# EAGLE schematic Comms_Main (EAGLE 7.7.0)

## Sheet 1 of 8
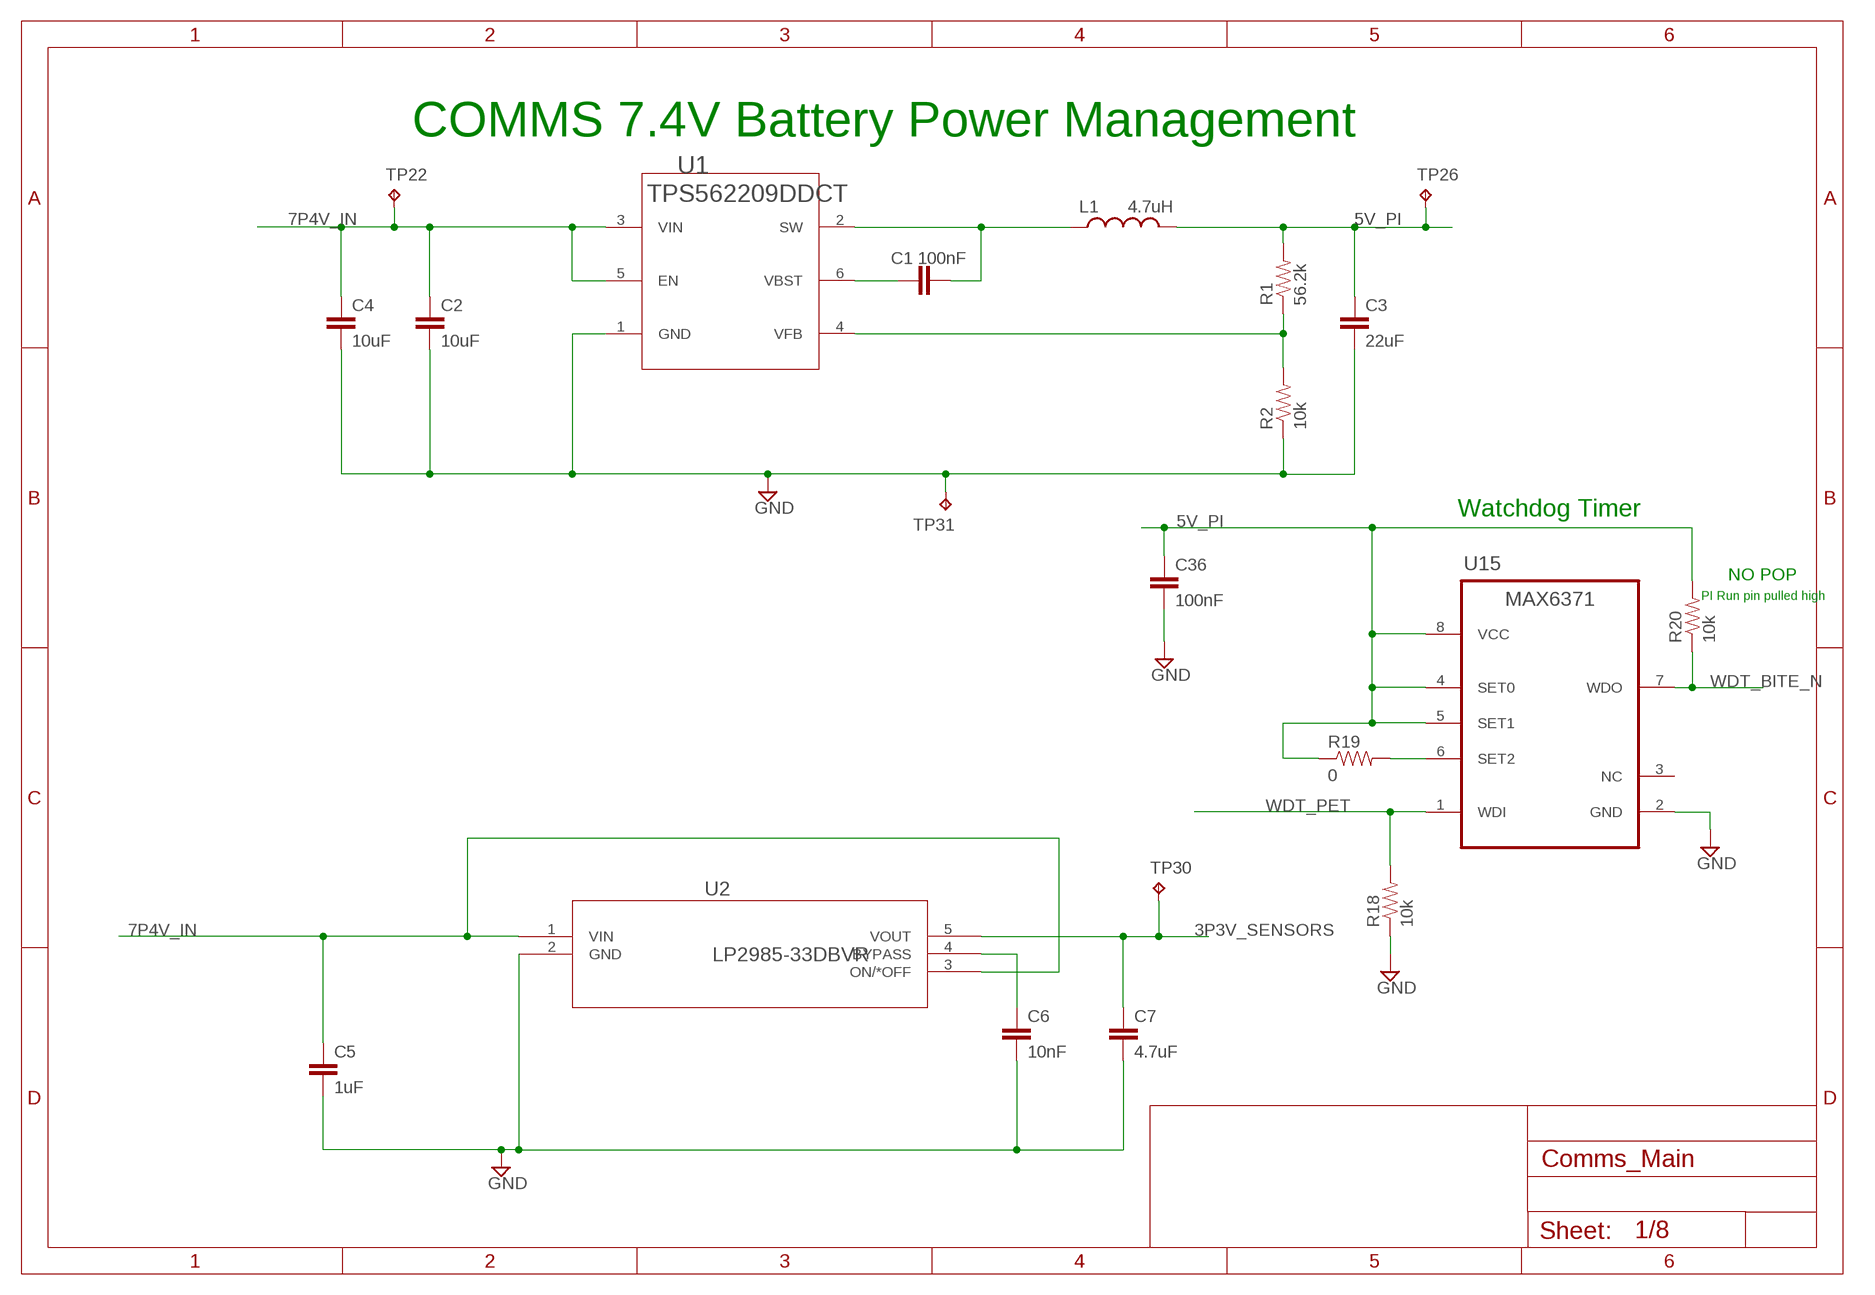
[diagram p0: schematic, sheet 1]

### Parts
C1  100nF  CAP_100NF0_0805  [C0805]
C2  10uF  CAP_10UF0_0805  [C0805]
C3  22uF  CAP_22UF0_1206  [C1206]
C4  10uF  CAP_10UF0_0805  [C0805]
C5  1uF  CAP_1UF0_0603  [C0603]
C6  10nF  CAP_10NF0_0805  [C0805]
C7  4.7uF  CAP_4UH7_0603  [C0603]
C36  100nF  CAP_100NF0_0603  [C0603]
L1  4.7uH  L_4UH7  [SRN6045]
R1  56.2k  RES_56R2_0603  [R0603]
R2  10k  RES_10R0_0603  [R0603]
R18  10k  RES_10R0_0603  [R0603]
R19  0  RES_0R0_0603  [R0603]
R20  10k  RES_10R0_0603  [R0603]
TP22  TPTP15R  [TP15R]
TP26  TPTP15R  [TP15R]
TP30  TPTP15R  [TP15R]
TP31  TPTP15R  [TP15R]
U1  TPS562209DDCT  TPS562209DDCR  [DDC0006A]
U2  LP2985-33DBVR  LP2985-33_DBV_5  [DBV5]
U15  MAX6371  MAX63XX71KA_SOT23  [SOT23P130X045-8N]

### Nets
3P3V_SENSORS: C7.1 TP30.TP U2.5(VOUT) ; also sheet 4,6
5V_PI: C3.1 C36.1 L1.2 R1.2 R19.1 R20.2 TP26.TP U15.4(SET0) U15.5(SET1) U15.8(VCC) ; also sheet 8
7P4V_IN: C2.1 C4.1 C5.1 TP22.TP U1.3(VIN) U1.5(EN) U2.1(VIN) U2.3(ON/*OFF) ; also sheet 8
GND: C2.2 C3.2 C4.2 C5.2 C6.2 C7.2 C36.2 R2.1 R18.1 TP31.TP U1.1(GND) U2.2(GND) U15.2(GND) ; also sheet 2,3,4,5,6,7,8
N$1: C1.1 U1.6(VBST)
N$2: C1.2 L1.1 U1.2(SW)
N$3: R1.1 R2.2 U1.4(VFB)
N$4: C6.1 U2.4(BYPASS)
N$59: R19.2 U15.6(SET2)
WDT_BITE_N: R20.1 U15.7(WDO) ; also sheet 8
WDT_PET: R18.2 U15.1(WDI) ; also sheet 8
Unconnected: U15.3(NC)

### Notes on the sheet
- COMMS 7.4V Battery Power Management
- Watchdog Timer
- NO POP
- PI Run pin pulled high

## Sheet 2 of 8
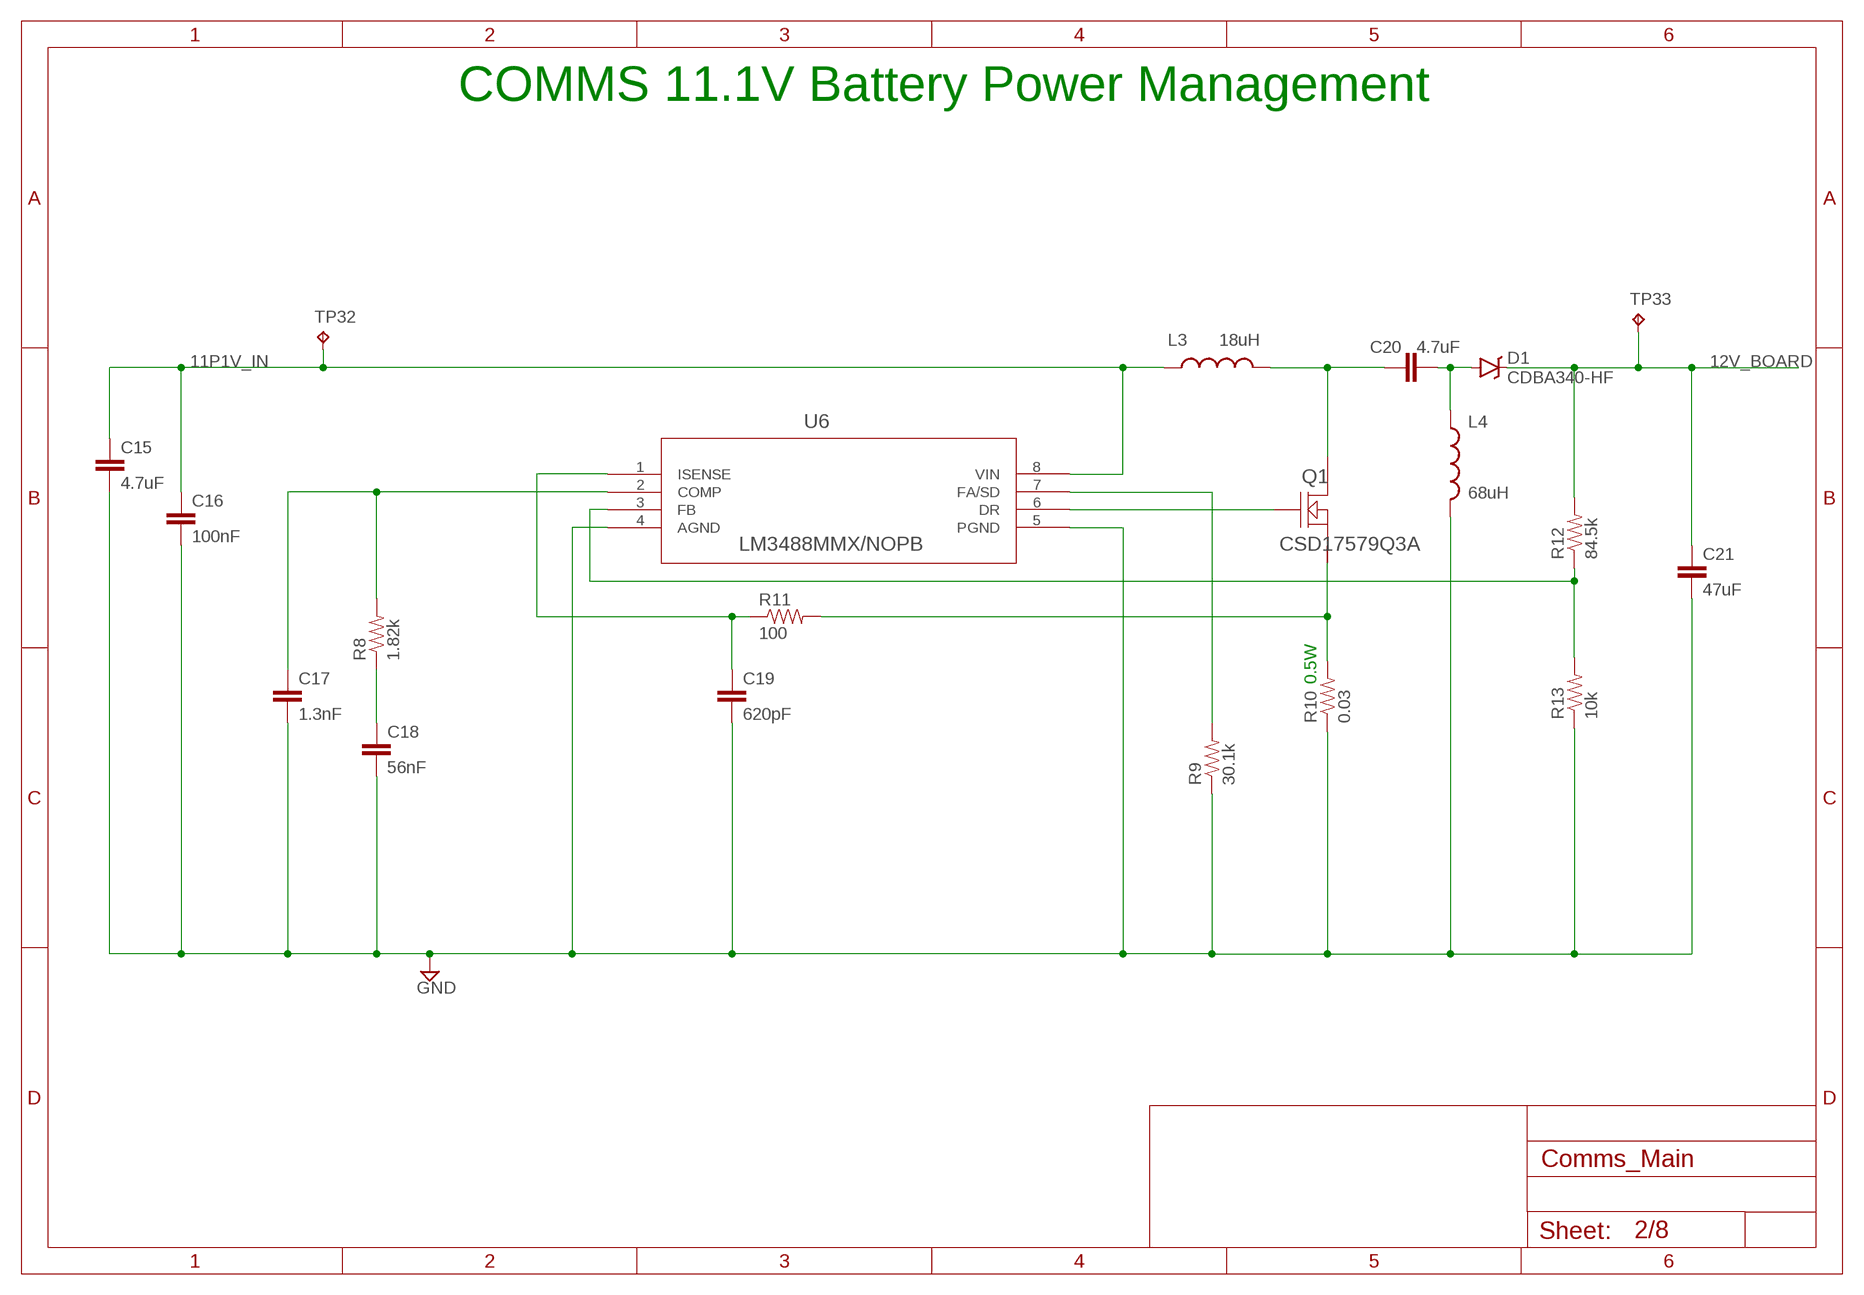
[diagram p1: schematic, sheet 2]

### Parts
C15  4.7uF  CAP_4UH7_1210  [C1210]
C16  100nF  CAP_100NF0_0805  [C0805]
C17  1.3nF  CAP_1NF3_0805  [C0805]
C18  56nF  CAP_56NF0_0603  [C0603]
C19  620pF  CAP_620PF0_0805  [C0805]
C20  4.7uF  CAP_4UH7_0805  [C0805]
C21  47uF  CAP_47UF0_1210  [C1210]
D1  CDBA340-HF  DIODE-SCHOTTKY_DO-214AC  [DO-214AC]
L3  18uH  L_18UH0-180ML  [SDR1006]
L4  68uH  L_68UH0-680ML  [SDR1806]
Q1  CSD17579Q3A  [DNH0008A]
R8  1.82k  RES_1R82_0805  [R0805]
R9  30.1k  RES_30R1_0603  [R0603]
R10  0.03  RES_0RS030_0805  [R0805]
R11  100  RES_0R100_0603  [R0603]
R12  84.5k  RES_84R5_0603  [R0603]
R13  10k  RES_10R0_0603  [R0603]
TP32  TPTP15R  [TP15R]
TP33  TPTP15R  [TP15R]
U6  LM3488MMX/NOPB  [MUA08A]

### Nets
11P1V_IN: C15.1 C16.1 L3.1 TP32.TP U6.8(VIN) ; also sheet 3,8
12V_BOARD: C21.1 D1.C R12.2 TP33.TP ; also sheet 3,8
GND: C15.2 C16.2 C17.2 C18.2 C19.2 C21.2 L4.2 R9.1 R10.1 R13.1 U6.4(AGND) U6.5(PGND) ; also sheet 1,3,4,5,6,7,8
N$12: C18.1 R8.1
N$13: C17.1 R8.2 U6.2(COMP)
N$14: R9.2 U6.7(FA/SD)
N$15: C19.1 R11.1 U6.1(ISENSE)
N$16: Q1.4(GATE) U6.6(DR)
N$17: Q1.1(SOURCE_2) R10.2 R11.2
N$18: C20.1 L3.2 Q1.5(DRAIN_2)
N$19: C20.2 D1.A L4.1
N$21: R12.1 R13.2 U6.3(FB)

### Notes on the sheet
- COMMS 11.1V Battery Power Management
- 0.5W

## Sheet 3 of 8
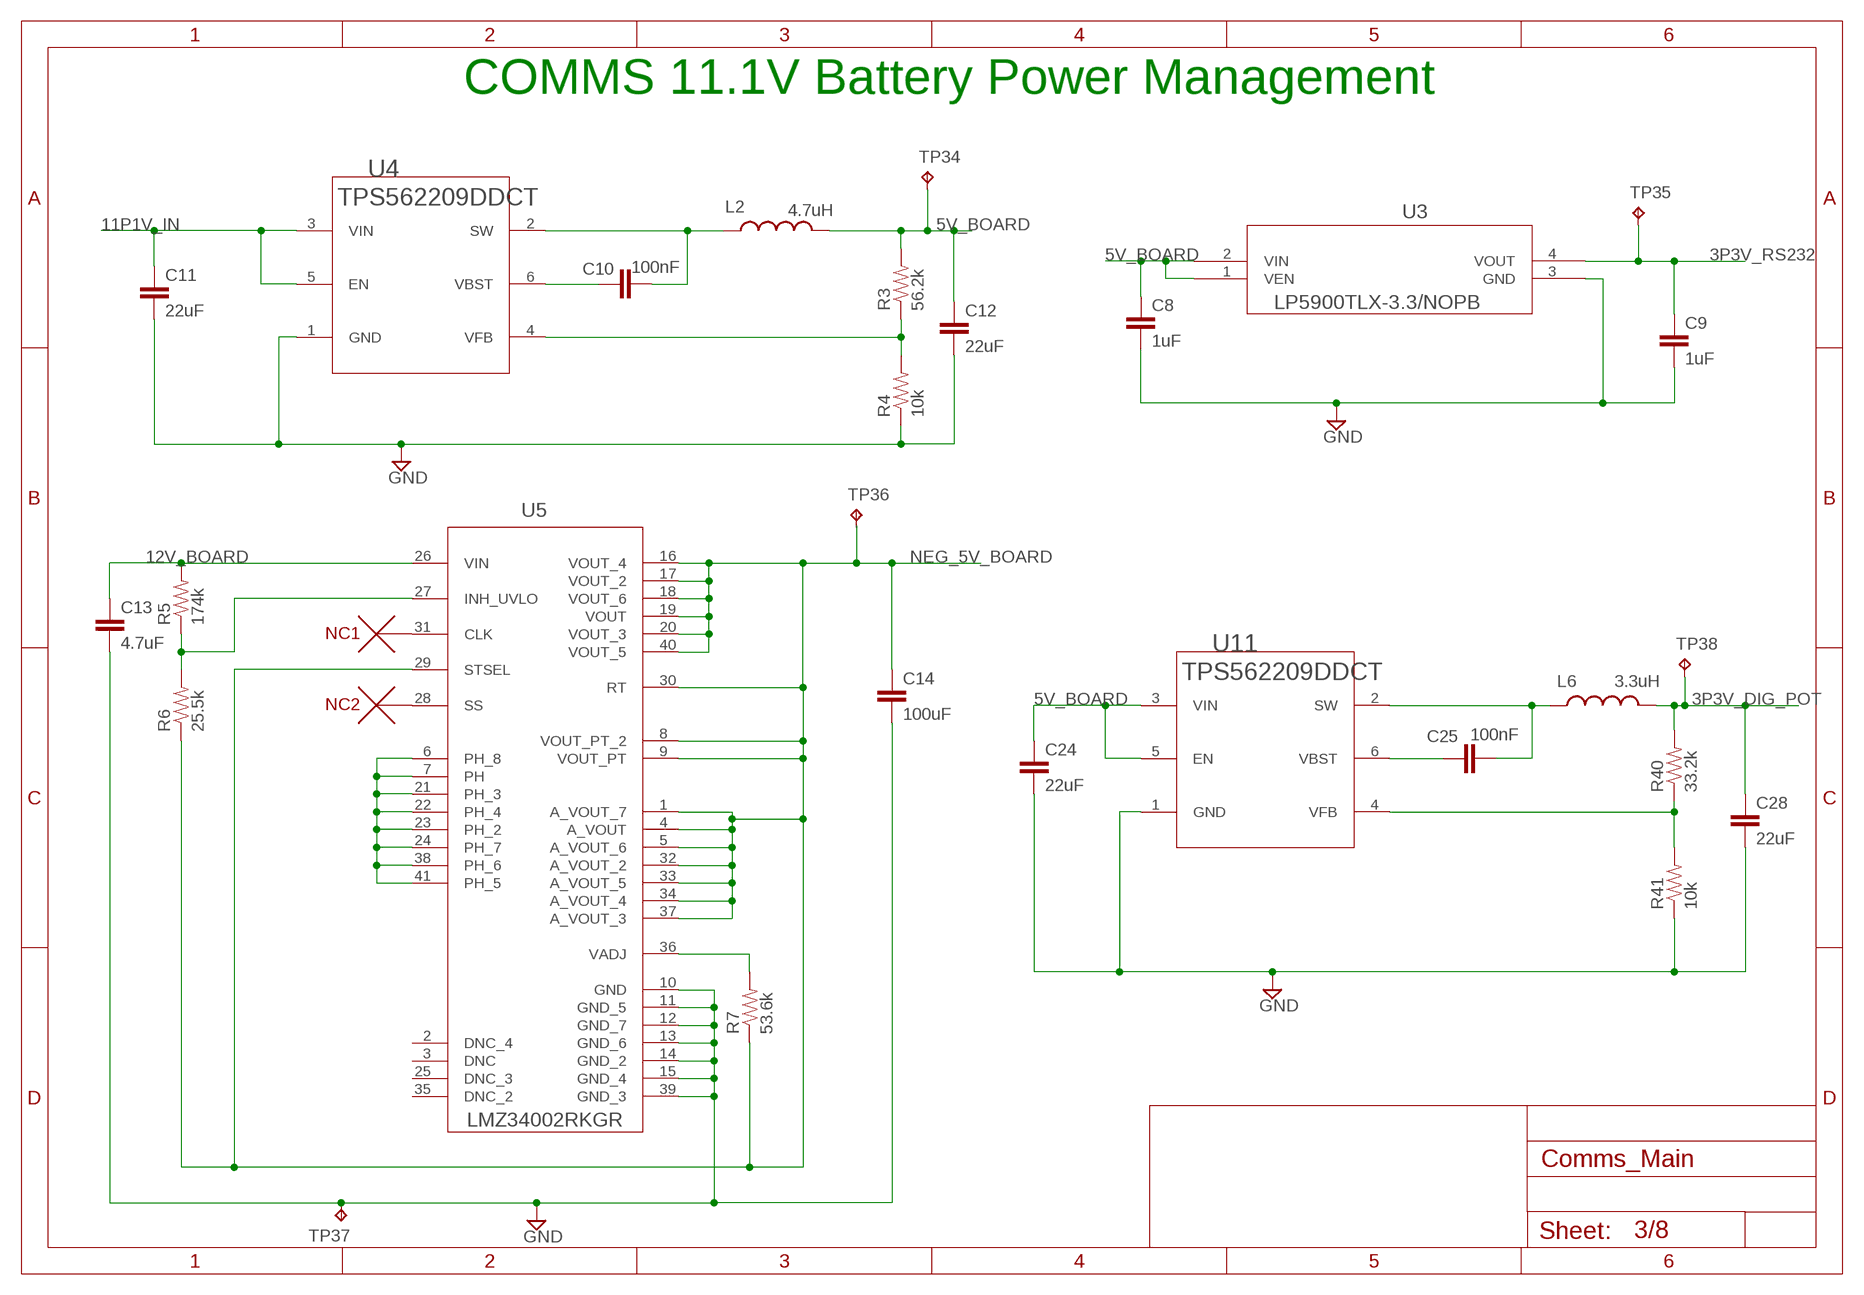
[diagram p2: schematic, sheet 3]

### Parts
C8  1uF  CAP_1UF0_0603  [C0603]
C9  1uF  CAP_1UF0_0603  [C0603]
C10  100nF  CAP_100NF0_0805  [C0805]
C11  22uF  CAP_22UF0_1210  [C1210]
C12  22uF  CAP_22UF0_1206  [C1206]
C13  4.7uF  CAP_4UH7_0805  [C0805]
C14  100uF  CAP_100UF0_1206  [C1206]
C24  22uF  CAP_22UF0_1206  [C1206]
C25  100nF  CAP_100NF0_0805  [C0805]
C28  22uF  CAP_22UF0_1206  [C1206]
L2  4.7uH  L_4UH7  [SRN6045]
L6  3.3uH  L_3UH3  [SRN6045]
NC1  NC  NO_CONNECT  (no package)
NC2  NC  NO_CONNECT  (no package)
R3  56.2k  RES_56R2_0603  [R0603]
R4  10k  RES_10R0_0603  [R0603]
R5  174k  RES_174R0_0603  [R0603]
R6  25.5k  RES_25R5_0603  [R0603]
R7  53.6k  RES_53R6_0603  [R0603]
R40  33.2k  RES_33R2_0603  [R0603]
R41  10k  RES_10R0_0603  [R0603]
TP34  TPTP15R  [TP15R]
TP35  TPTP15R  [TP15R]
TP36  TPTP15R  [TP15R]
TP37  TPTP15R  [TP15R]
TP38  TPTP15R  [TP15R]
U3  LP5900TLX-3.3/NOPB  [TLA04BCA]
U4  TPS562209DDCT  TPS562209DDCR  [DDC0006A]
U5  LMZ34002RKGR  [RKG0041A]
U11  TPS562209DDCT  TPS562209DDCR  [DDC0006A]

### Nets
3P3V_DIG_POT: C28.1 L6.2 R40.2 TP38.TP ; also sheet 6
3P3V_RS232: C9.1 TP35.TP U3.4(VOUT) ; also sheet 7
5V_BOARD: C8.1 C12.1 C24.1 L2.2 R3.2 TP34.TP U3.1(VEN) U3.2(VIN) U11.3(VIN) U11.5(EN) ; also sheet 7,8
11P1V_IN: C11.1 U4.3(VIN) U4.5(EN) ; also sheet 2,8
12V_BOARD: C13.1 R5.2 U5.26(VIN) ; also sheet 2,8
GND: C8.2 C9.2 C11.2 C12.2 C13.2 C14.2 C24.2 C28.2 R4.1 R41.1 TP37.TP U3.3(GND) U4.1(GND) U5.10(GND) U5.11(GND_5) U5.12(GND_7) U5.13(GND_6) U5.14(GND_2) U5.15(GND_4) U5.39(GND_3) U11.1(GND) ; also sheet 1,2,4,5,6,7,8
N$5: C10.1 U4.6(VBST)
N$6: C10.2 L2.1 U4.2(SW)
N$7: R3.1 R4.2 U4.4(VFB)
N$8: C25.2 L6.1 U11.2(SW)
N$9: R5.1 R6.2 U5.27(INH_UVLO)
N$10: R7.2 U5.36(VADJ)
N$11: U5.6(PH_8) U5.7(PH) U5.21(PH_3) U5.22(PH_4) U5.23(PH_2) U5.24(PH_7) U5.38(PH_6) U5.41(PH_5)
N$47: NC1.NC U5.31(CLK)
N$48: R40.1 R41.2 U11.4(VFB)
N$51: NC2.NC U5.28(SS)
N$61: C25.1 U11.6(VBST)
NEG_5V_BOARD: C14.1 R6.1 R7.1 U5.1(A_VOUT_7) U5.4(A_VOUT) U5.5(A_VOUT_6) U5.8(VOUT_PT_2) U5.9(VOUT_PT) U5.16(VOUT_4) U5.17(VOUT_2) U5.18(VOUT_6) U5.19(VOUT) U5.20(VOUT_3) U5.29(STSEL) U5.30(RT) U5.32(A_VOUT_2) U5.33(A_VOUT_5) U5.34(A_VOUT_4) U5.37(A_VOUT_3) U5.40(VOUT_5) ; also sheet 7
Unconnected: TP36.TP U5.2(DNC_4) U5.3(DNC) U5.25(DNC_3) U5.35(DNC_2)

### Notes on the sheet
- COMMS 11.1V Battery Power Management

## Sheet 4 of 8
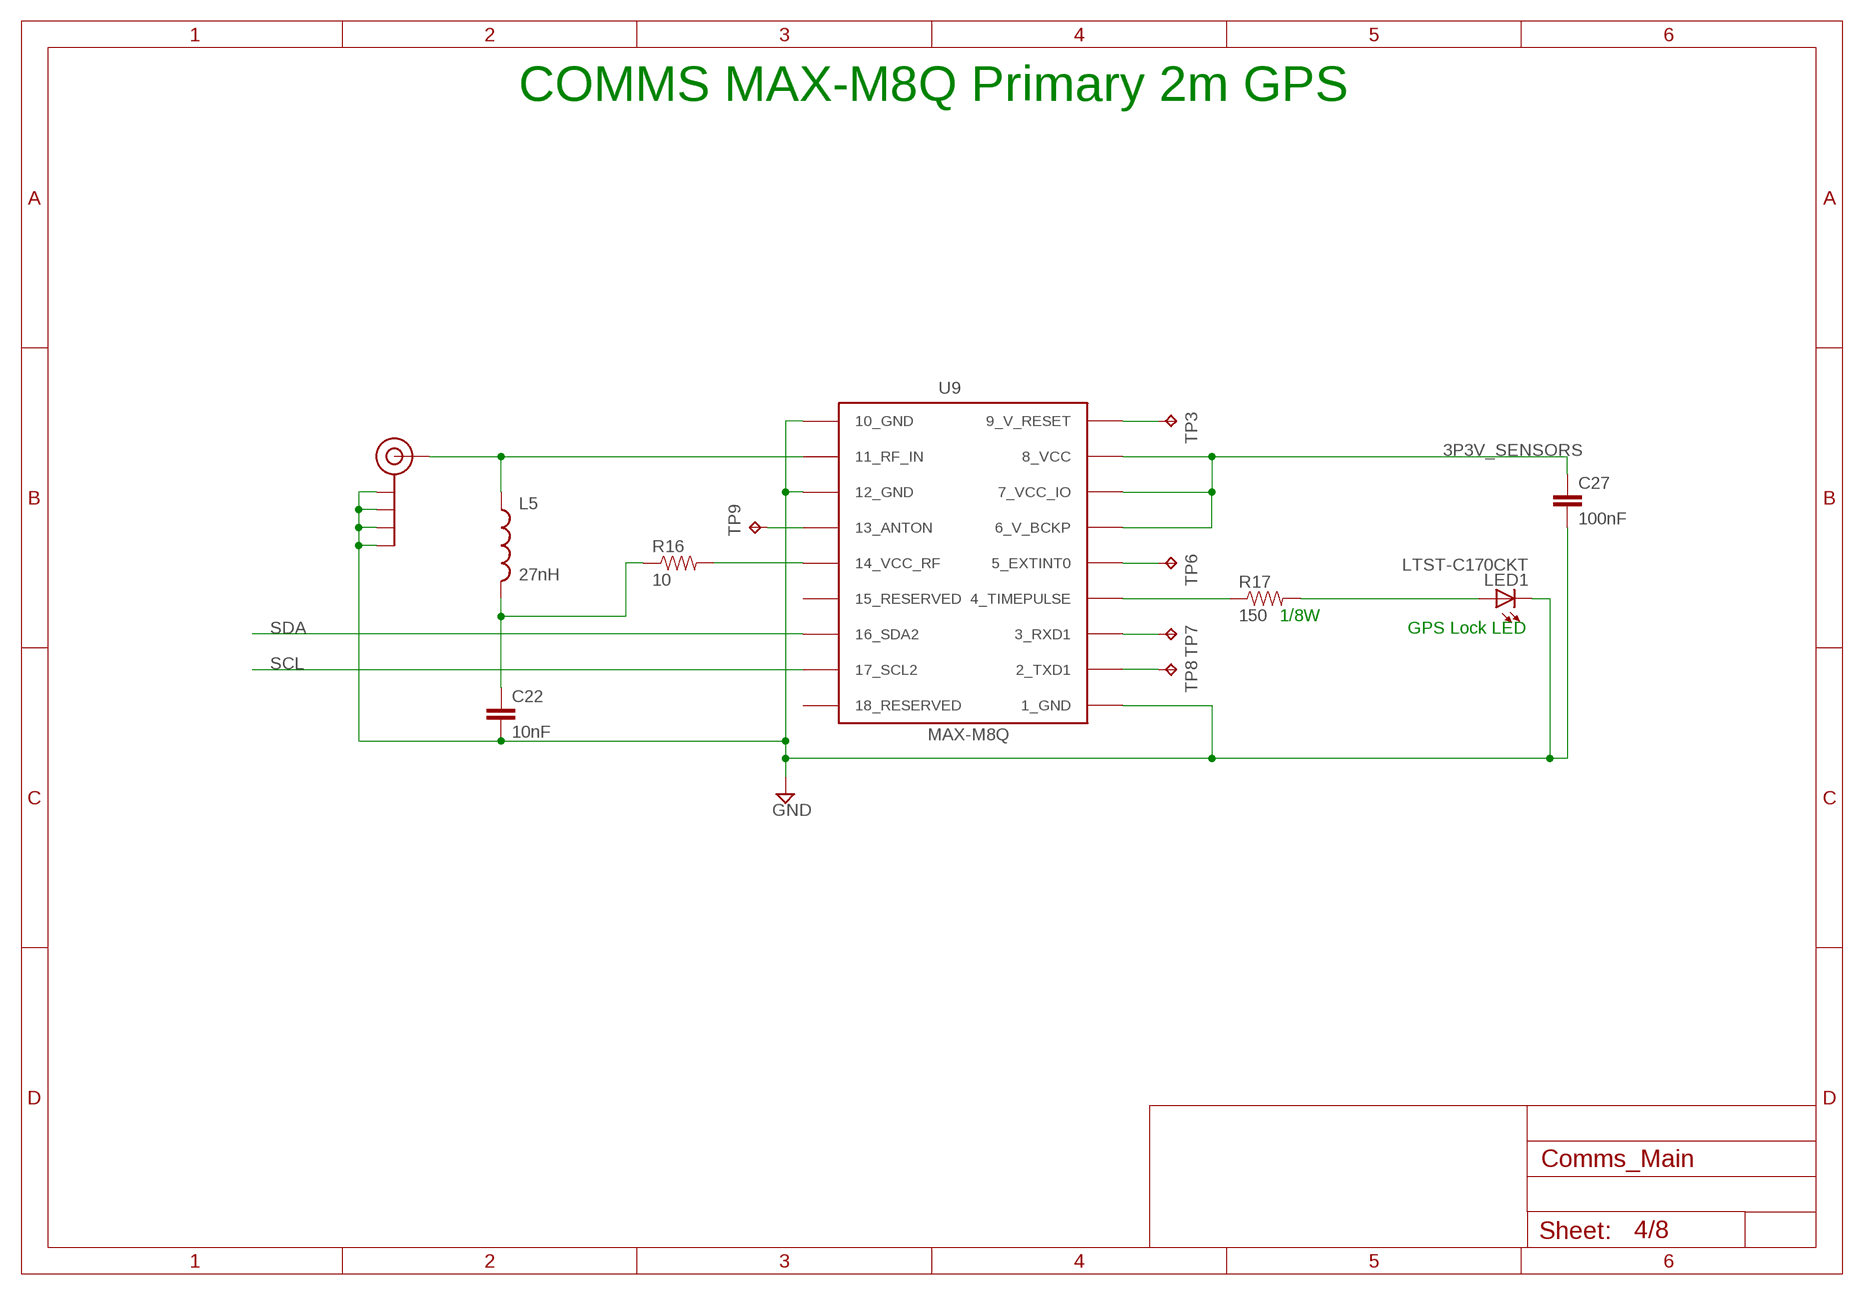
[diagram p3: schematic, sheet 4]

### Parts
C22  10nF  CAP_10NF0_0805  [C0805]
C27  100nF  CAP_100NF0_0603  [C0603]
J1  WRL-00593  SMA_EDGE  [SMA-EDGE]
L5  27nH  L_27NH0_0603  [L0603]
LED1  LTST-C170CKT  LEDCHIP-LED0805  [CHIP-LED0805]
R16  10  RES_0R10_0603  [R0603]
R17  150  RES_0R150_0805  [R0805]
TP3  TPTP15R  [TP15R]
TP6  TPTP15R  [TP15R]
TP7  TPTP15R  [TP15R]
TP8  TPTP15R  [TP15R]
TP9  TPTP15R  [TP15R]
U9  MAX-M8Q  UBLOX_MAX  [UBLOX_MAX]

### Nets
3P3V_SENSORS: C27.1 U9.6_V_BCKP U9.7_VCC_IO U9.8_VCC ; also sheet 1,6
GND: C22.2 C27.2 J1.GND@0(GND) J1.GND@1(GND) J1.GND@2(GND) J1.GND@3(GND) LED1.C U9.1_GND U9.10_GND U9.12_GND ; also sheet 1,2,3,5,6,7,8
N$20: R16.2 U9.14_VCC_RF
N$22: C22.1 L5.2 R16.1
N$23: R17.1 U9.4_TIMEPULSE
N$24: J1.SIG(SIGNAL) L5.1 U9.11_RF_IN
N$25: LED1.A R17.2
N$26: TP6.TP U9.5_EXTINT0
N$27: TP7.TP U9.3_RXD1
N$28: TP8.TP U9.2_TXD1
N$44: TP9.TP U9.13_ANTON
N$45: TP3.TP U9.9_V_RESET
SCL: U9.17_SCL2 ; also sheet 6,8
SDA: U9.16_SDA2 ; also sheet 6,8
Unconnected: U9.15_RESERVED U9.18_RESERVED

### Notes on the sheet
- COMMS MAX-M8Q Primary 2m GPS
- 1/8W
- GPS Lock LED

## Sheet 5 of 8
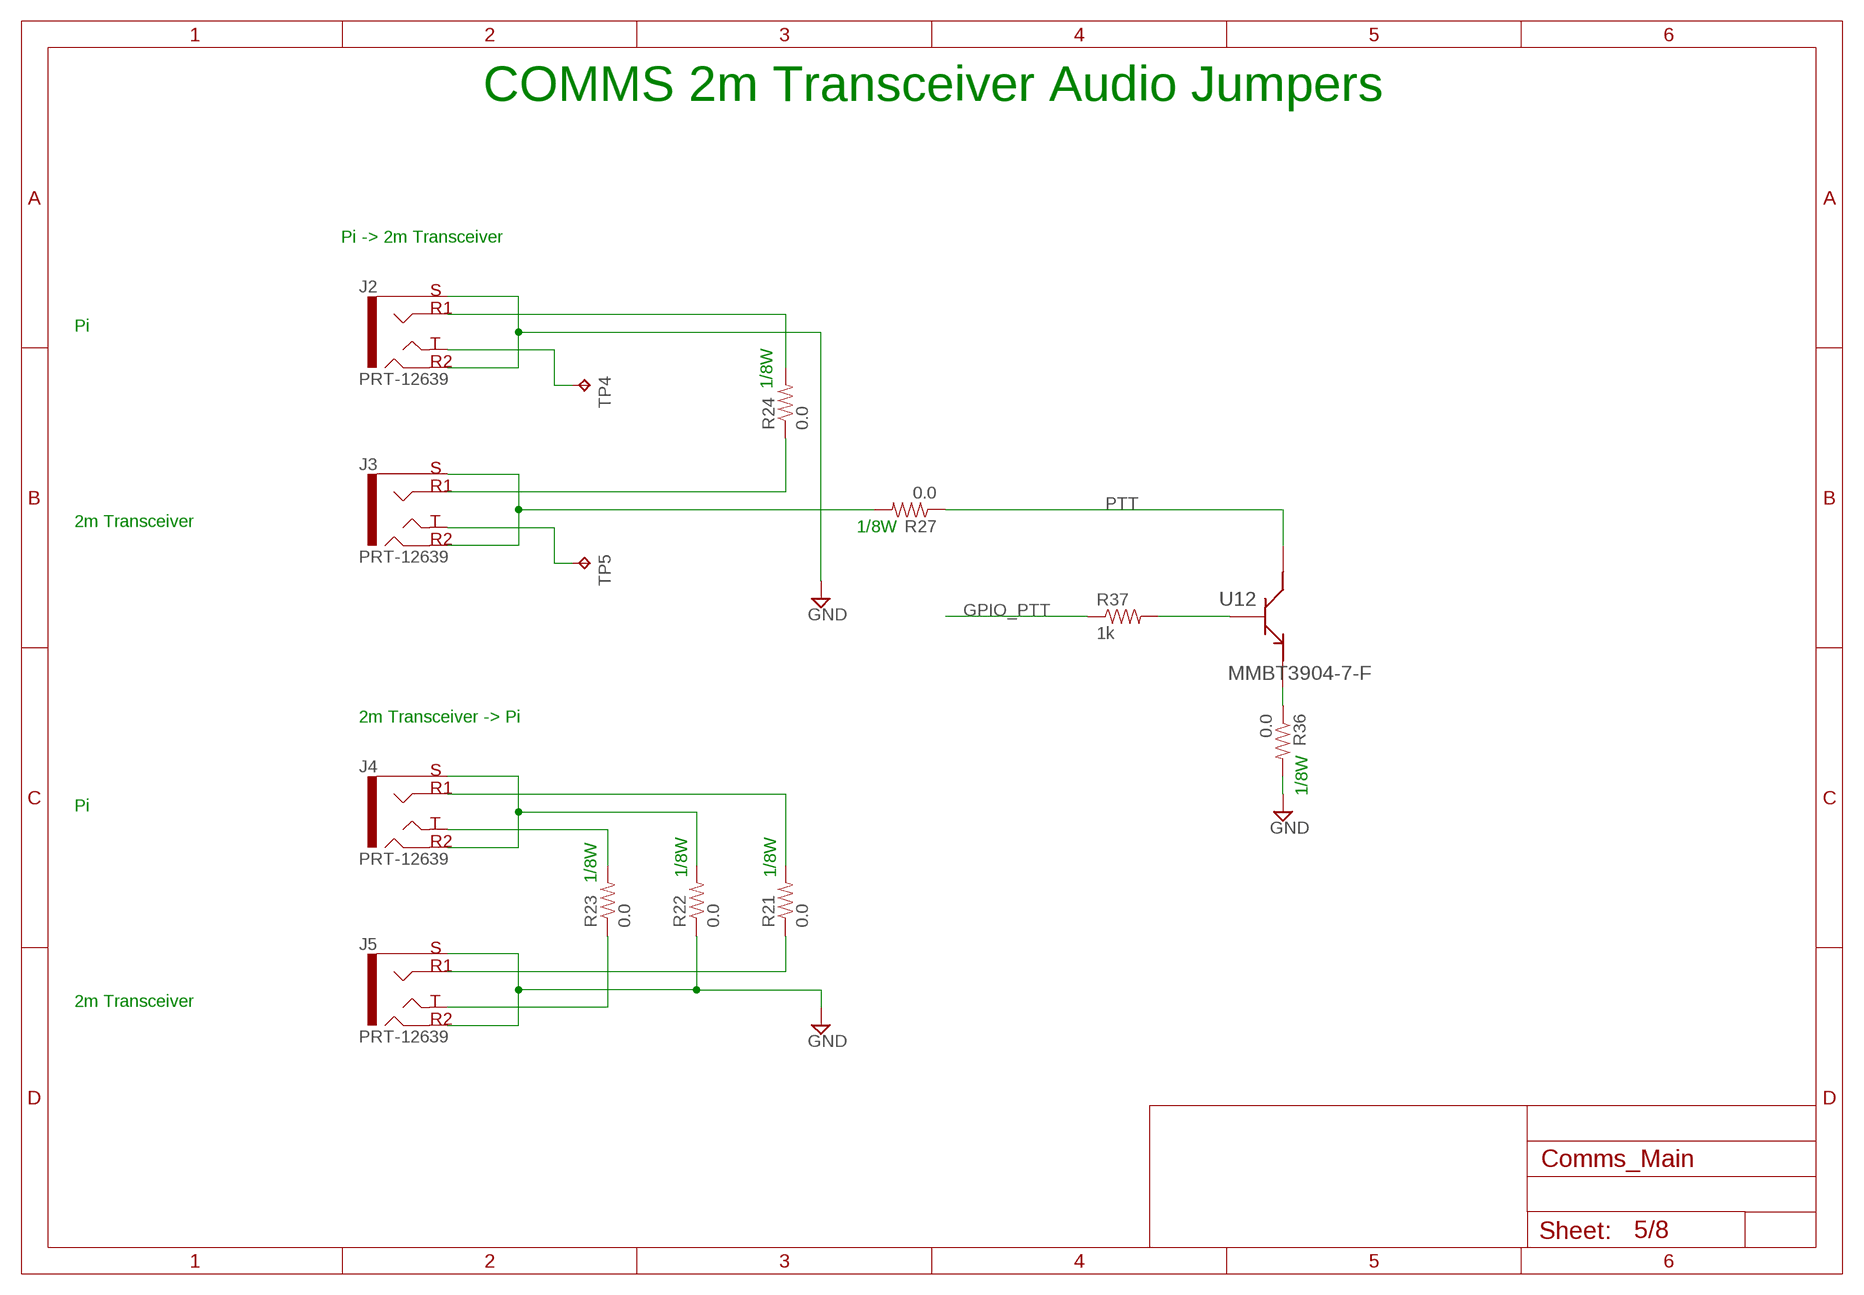
[diagram p4: schematic, sheet 5]

### Parts
J2  PRT-12639  [AUDIO-JACK-TRRS-SMD]
J3  PRT-12639  [AUDIO-JACK-TRRS-SMD]
J4  PRT-12639  [AUDIO-JACK-TRRS-SMD]
J5  PRT-12639  [AUDIO-JACK-TRRS-SMD]
R21  0.0  RES_0R0_0805  [R0805]
R22  0.0  RES_0R0_0805  [R0805]
R23  0.0  RES_0R0_0805  [R0805]
R24  0.0  RES_0R0_0805  [R0805]
R27  0.0  RES_0R0_0805  [R0805]
R36  0.0  RES_0R0_0805  [R0805]
R37  1k  RES_1R0_0603  [R0603]
TP4  TPTP15R  [TP15R]
TP5  TPTP15R  [TP15R]
U12  MMBT3904-7-F  [SOT103P240X110-3N]

### Nets
GND: J2.EARTH J2.RING2 J5.EARTH J5.RING2 R22.1 R36.2 ; also sheet 1,2,3,4,6,7,8
GPIO_PTT: R37.1 ; also sheet 8
N$29: J2.RING1 R24.2
N$30: J5.TIP R23.1
N$31: J3.RING1 R24.1
N$32: J5.RING1 R21.1
N$33: J4.RING1 R21.2
N$34: J4.EARTH J4.RING2 R22.2
N$35: J4.TIP R23.2
N$36: J2.TIP TP4.TP
N$37: J3.EARTH J3.RING2 R27.2
N$38: J3.TIP TP5.TP
N$52: R36.1 U12.2(E)
N$53: R37.2 U12.1(B)
PTT: R27.1 U12.3(C)

### Notes on the sheet
- COMMS 2m Transceiver Audio Jumpers
- Pi -> 2m Transceiver
- Pi
- 1/8W
- 2m Transceiver
- 1/8W
- 2m Transceiver -> Pi
- 1/8W
- Pi
- 1/8W | 1/8W
- 1/8W
- 2m Transceiver

## Sheet 6 of 8
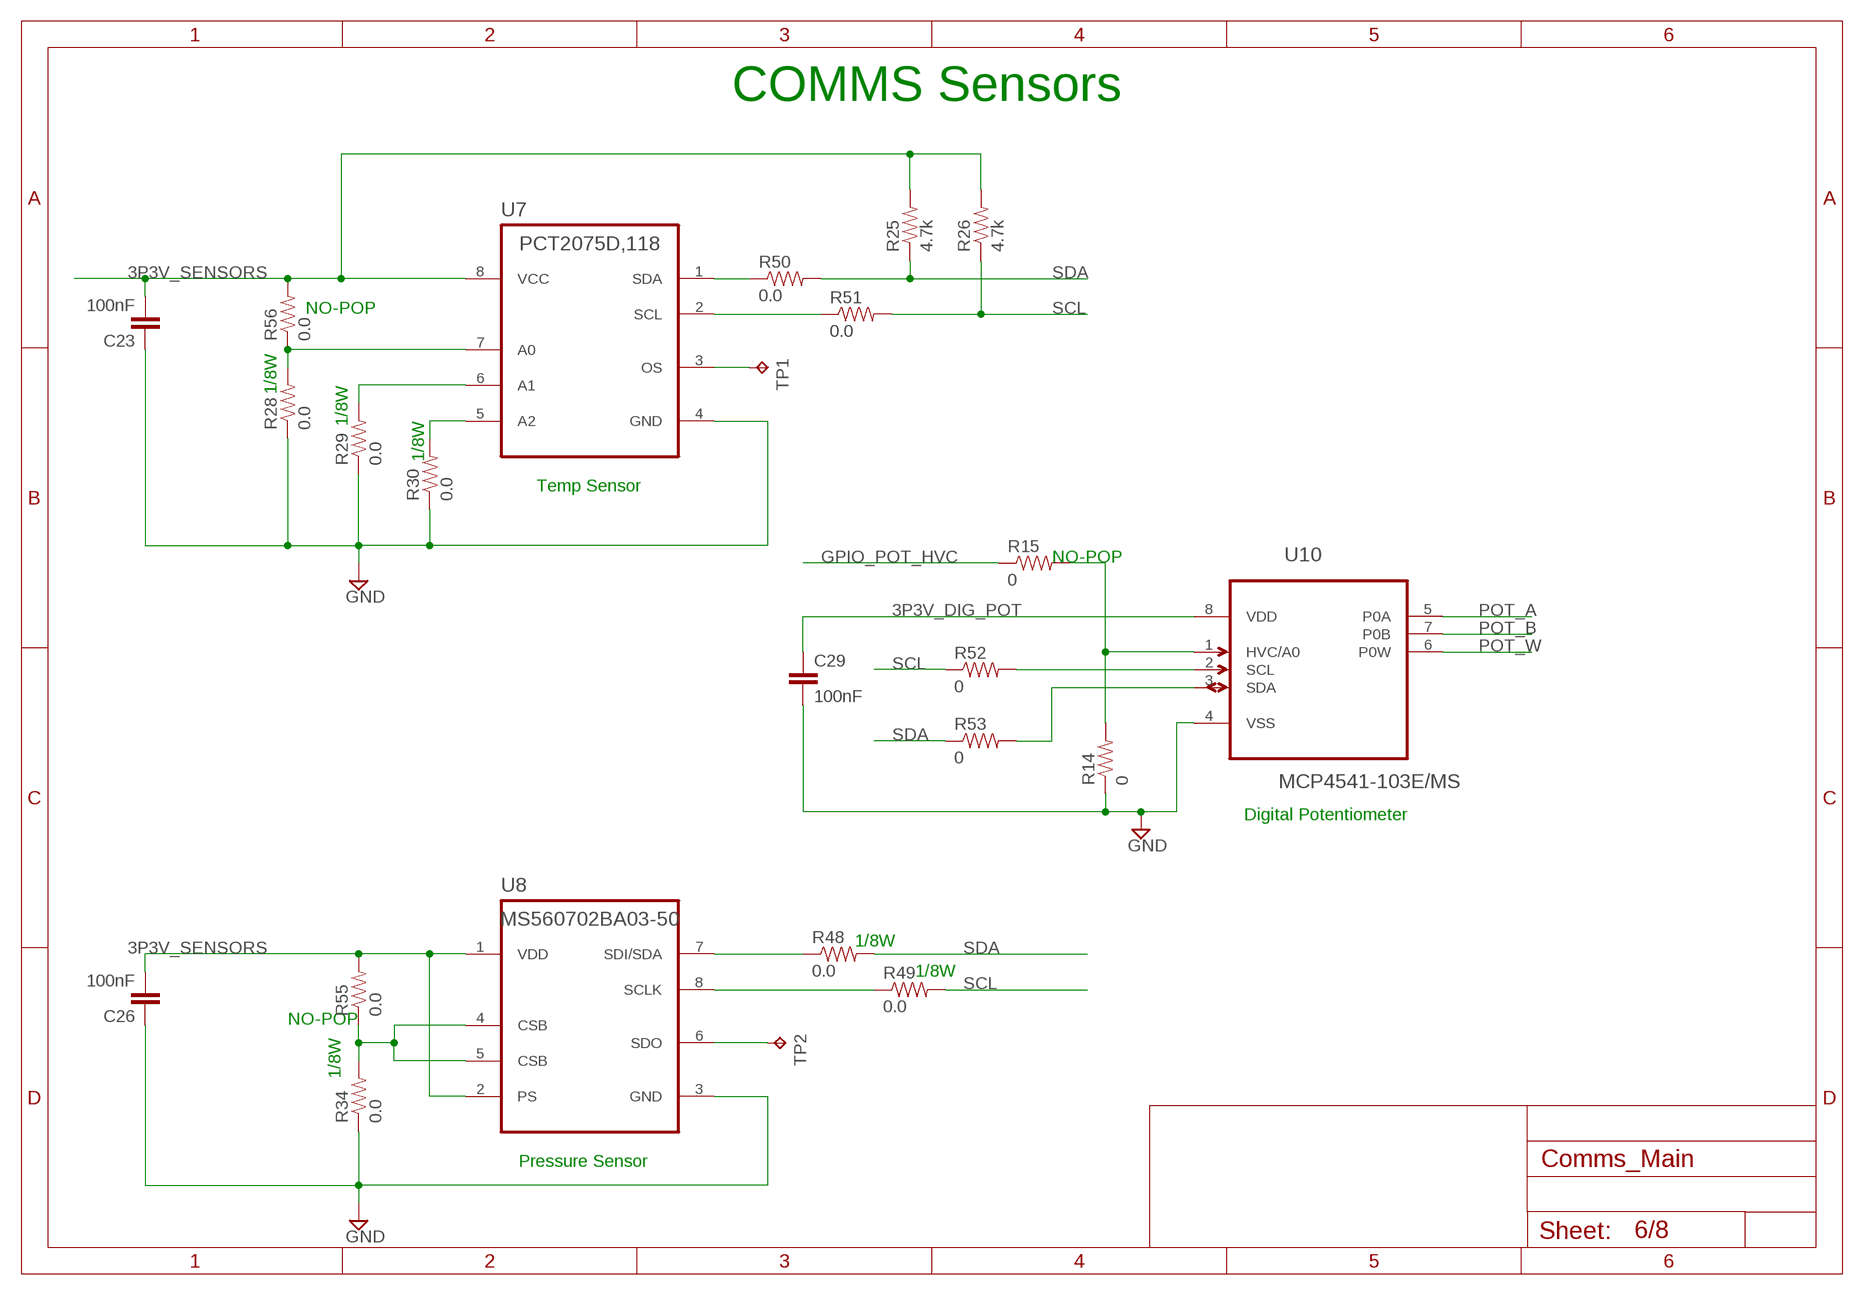
[diagram p5: schematic, sheet 6]

### Parts
C23  100nF  CAP_100NF0_0603  [C0603]
C26  100nF  CAP_100NF0_0603  [C0603]
C29  100nF  CAP_100NF0_0603  [C0603]
R14  0  RES_0R0_0603  [R0603]
R15  0  RES_0R0_0603  [R0603]
R25  4.7k  RES_4R7_0603  [R0603]
R26  4.7k  RES_4R7_0603  [R0603]
R28  0.0  RES_0R0_0805  [R0805]
R29  0.0  RES_0R0_0805  [R0805]
R30  0.0  RES_0R0_0805  [R0805]
R34  0.0  RES_0R0_0805  [R0805]
R48  0.0  RES_0R0_0805  [R0805]
R49  0.0  RES_0R0_0805  [R0805]
R50  0.0  RES_0R0_0805  [R0805]
R51  0.0  RES_0R0_0805  [R0805]
R52  0  RES_0R0_0603  [R0603]
R53  0  RES_0R0_0603  [R0603]
R55  0.0  RES_0R0_0805  [R0805]
R56  0.0  RES_0R0_0805  [R0805]
TP1  TPTP15R  [TP15R]
TP2  TPTP15R  [TP15R]
U7  PCT2075D,118  PCT2075D,118SOIC8  [SOIC127P130X0600-8N]
U8  MS560702BA03-50  MS5607-02BA03_8SMD  [SMD125P110X060-8N]
U10  MCP4541-103E/MS  [SOP65P490X110-8N]

### Nets
3P3V_DIG_POT: C29.1 U10.8(VDD) ; also sheet 3
3P3V_SENSORS: C23.2 C26.2 R25.2 R26.2 R55.2 R56.2 U7.8(VCC) U8.1(VDD) U8.2(PS) ; also sheet 1,4
GND: C23.1 C26.1 C29.2 R14.1 R28.1 R29.1 R30.1 R34.1 U7.4(GND) U8.3(GND) U10.4(VSS) ; also sheet 1,2,3,4,5,7,8
GPIO_POT_HVC: R15.1 ; also sheet 8
N$39: R28.2 R56.1 U7.7(A0)
N$40: R29.2 U7.6(A1)
N$41: R30.2 U7.5(A2)
N$42: TP1.TP U7.3(OS)
N$43: R34.2 R55.1 U8.4(CSB) U8.5(CSB)
N$46: TP2.TP U8.6(SDO)
N$49: R52.2 U10.2(SCL)
N$50: R14.2 R15.2 U10.1(HVC/A0)
N$64: R53.2 U10.3(SDA)
POT_A: U10.5(P0A) ; also sheet 8
POT_B: U10.7(P0B) ; also sheet 8
POT_W: U10.6(P0W) ; also sheet 8
PRES_SCL: R49.1 U8.8(SCLK)
PRES_SDA: R48.1 U8.7(SDI/SDA)
SCL: R26.1 R49.2 R51.2 R52.1 ; also sheet 4,8
SDA: R25.1 R48.2 R50.2 R53.1 ; also sheet 4,8
TEMP_SCL: R51.1 U7.2(SCL)
TEMP_SDA: R50.1 U7.1(SDA)

### Notes on the sheet
- COMMS Sensors
- NO-POP
- 1/8W
- 1/8W
- 1/8W
- Temp Sensor
- NO-POP
- Digital Potentiometer
- 1/8W
- 1/8W
- NO-POP
- 1/8W
- Pressure Sensor

## Sheet 7 of 8
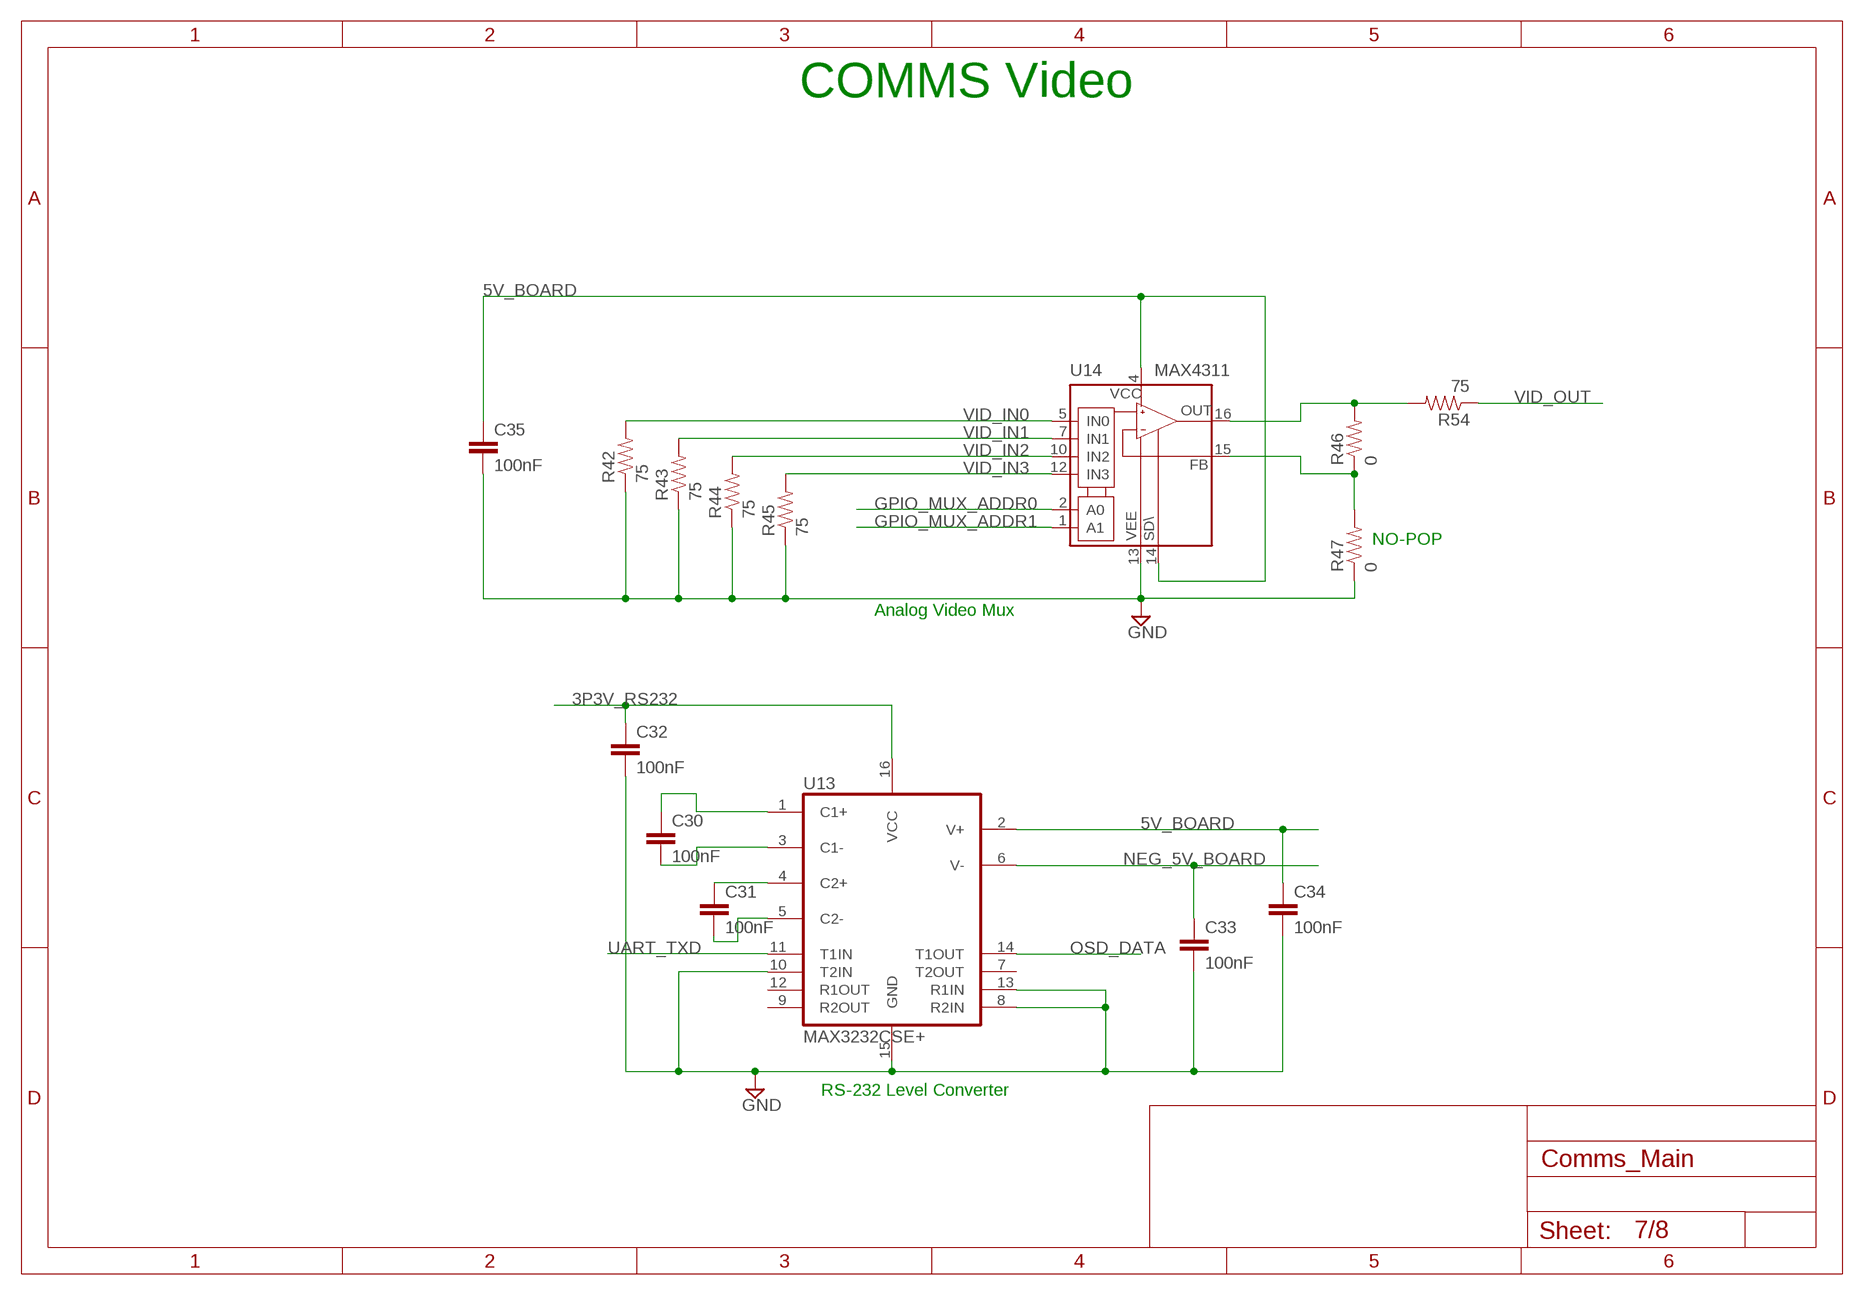
[diagram p6: schematic, sheet 7]

### Parts
C30  100nF  CAP_100NF0_0805  [C0805]
C31  100nF  CAP_100NF0_0805  [C0805]
C32  100nF  CAP_100NF0_0805  [C0805]
C33  100nF  CAP_100NF0_0805  [C0805]
C34  100nF  CAP_100NF0_0805  [C0805]
C35  100nF  CAP_100NF0_0805  [C0805]
R42  75  RES_0R75_0603  [R0603]
R43  75  RES_0R75_0603  [R0603]
R44  75  RES_0R75_0603  [R0603]
R45  75  RES_0R75_0603  [R0603]
R46  0  RES_0R0_0603  [R0603]
R47  0  RES_0R0_0603  [R0603]
R54  75  RES_0R75_0603  [R0603]
U13  MAX3232CSE+  MAX232SOIC16  [SO016]
U14  MAX4311  MAX4311EEE  [QSOP16]

### Nets
3P3V_RS232: C32.1 U13.16(VCC) ; also sheet 3
5V_BOARD: C34.1 C35.1 U13.2(V+) U14.4(V+) U14.14(!SHDN) ; also sheet 3,8
GND: C32.2 C33.2 C34.2 C35.2 R42.1 R43.1 R44.1 R45.1 R47.1 U13.8(R2IN) U13.10(T2IN) U13.13(R1IN) U13.15(GND) U14.13(V-) ; also sheet 1,2,3,4,5,6,8
GPIO_MUX_ADDR0: U14.2(A0) ; also sheet 8
GPIO_MUX_ADDR1: U14.1(A1) ; also sheet 8
N$54: C30.1 U13.1(C1+)
N$55: C30.2 U13.3(C1-)
N$56: C31.1 U13.4(C2+)
N$57: C31.2 U13.5(C2-)
N$58: R46.2 R54.2 U14.16(OUT)
N$63: R46.1 R47.2 U14.15(FB)
NEG_5V_BOARD: C33.1 U13.6(V-) ; also sheet 3
OSD_DATA: U13.14(T1OUT) ; also sheet 8
UART_TXD: U13.11(T1IN) ; also sheet 8
VID_IN0: R42.2 U14.5(IN0) ; also sheet 8
VID_IN1: R43.2 U14.7(IN1) ; also sheet 8
VID_IN2: R44.2 U14.10(IN2) ; also sheet 8
VID_IN3: R45.2 U14.12(IN3) ; also sheet 8
VID_OUT: R54.1 ; also sheet 8
Unconnected: U13.7(T2OUT) U13.9(R2OUT) U13.12(R1OUT)

### Notes on the sheet
- COMMS Video
- NO-POP
- Analog Video Mux
- RS-232 Level Converter

## Sheet 8 of 8
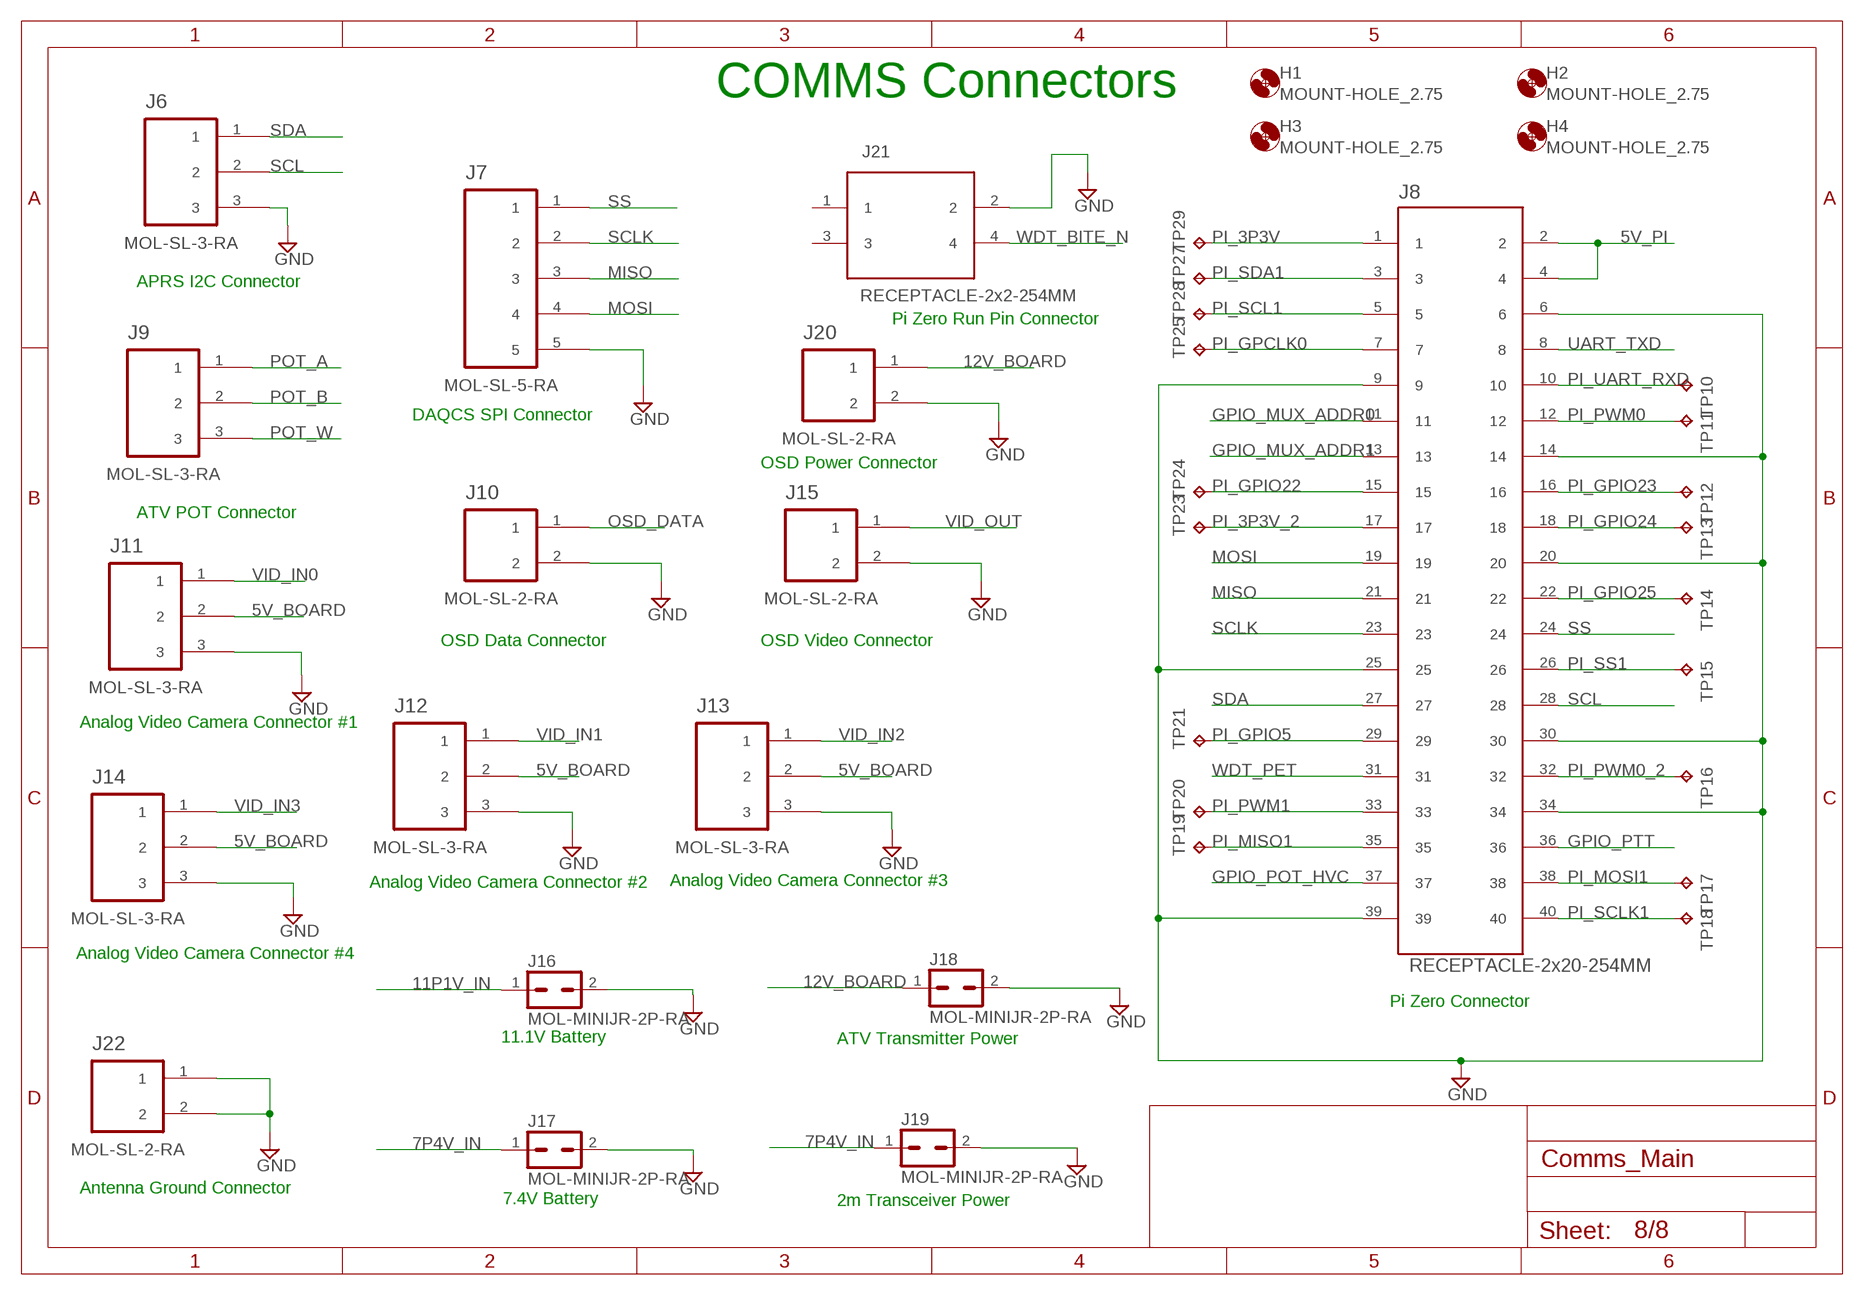
[diagram p7: schematic, sheet 8]

### Parts
H1  MOUNT-HOLE_2.75  [2,75_HOLE_RASPI]
H2  MOUNT-HOLE_2.75  [2,75_HOLE_RASPI]
H3  MOUNT-HOLE_2.75  [2,75_HOLE_RASPI]
H4  MOUNT-HOLE_2.75  [2,75_HOLE_RASPI]
J6  MOL-SL-3-RA  MOLSL_3PIN_SL3RA_RA  [MOLSL-3-RA]
J7  MOL-SL-5-RA  MOLSL_5PIN_SL4RA_RA  [MOLSL-5-RA]
J8  RECEPTACLE-2x20-254MM  RECEPTACLE-2X20-254MM  [HEADER-2X20-254MM]
J9  MOL-SL-3-RA  MOLSL_3PIN_SL3RA_RA  [MOLSL-3-RA]
J10  MOL-SL-2-RA  MOLSL_2PIN_SL2RA_RA  [MOLSL-2-RA]
J11  MOL-SL-3-RA  MOLSL_3PIN_SL3RA_RA  [MOLSL-3-RA]
J12  MOL-SL-3-RA  MOLSL_3PIN_SL3RA_RA  [MOLSL-3-RA]
J13  MOL-SL-3-RA  MOLSL_3PIN_SL3RA_RA  [MOLSL-3-RA]
J14  MOL-SL-3-RA  MOLSL_3PIN_SL3RA_RA  [MOLSL-3-RA]
J15  MOL-SL-2-RA  MOLSL_2PIN_SL2RA_RA  [MOLSL-2-RA]
J16  MOL-MINIJR-2P-RA  39-30-02  [39-30-?02?]
J17  MOL-MINIJR-2P-RA  39-30-02  [39-30-?02?]
J18  MOL-MINIJR-2P-RA  39-30-02  [39-30-?02?]
J19  MOL-MINIJR-2P-RA  39-30-02  [39-30-?02?]
J20  MOL-SL-2-RA  MOLSL_2PIN_SL2RA_RA  [MOLSL-2-RA]
J21  RECEPTACLE-2x2-254MM  RECEPTACLE-2X2-254MM  [HEADER-2X2-254MM]
J22  MOL-SL-2-RA  MOLSL_2PIN_SL2RA_RA  [MOLSL-2-RA]
TP10  TPTP15R  [TP15R]
TP11  TPTP15R  [TP15R]
TP12  TPTP15R  [TP15R]
TP13  TPTP15R  [TP15R]
TP14  TPTP15R  [TP15R]
TP15  TPTP15R  [TP15R]
TP16  TPTP15R  [TP15R]
TP17  TPTP15R  [TP15R]
TP18  TPTP15R  [TP15R]
TP19  TPTP15R  [TP15R]
TP20  TPTP15R  [TP15R]
TP21  TPTP15R  [TP15R]
TP23  TPTP15R  [TP15R]
TP24  TPTP15R  [TP15R]
TP25  TPTP15R  [TP15R]
TP27  TPTP15R  [TP15R]
TP28  TPTP15R  [TP15R]
TP29  TPTP15R  [TP15R]

### Nets
5V_BOARD: J11.2 J12.2 J13.2 J14.2 ; also sheet 3,7
5V_PI: J8.2 J8.4 ; also sheet 1
7P4V_IN: J17.1 J19.1 ; also sheet 1
11P1V_IN: J16.1 ; also sheet 2,3
12V_BOARD: J18.1 J20.1 ; also sheet 2,3
GND: J6.3 J7.5 J8.6 J8.9 J8.14 J8.20 J8.25 J8.30 J8.34 J8.39 J10.2 J11.3 J12.3 J13.3 J14.3 J15.2 J16.2 J17.2 J18.2 J19.2 J20.2 J21.2 J22.1 J22.2 ; also sheet 1,2,3,4,5,6,7
GPIO_MUX_ADDR0: J8.11 ; also sheet 7
GPIO_MUX_ADDR1: J8.13 ; also sheet 7
GPIO_POT_HVC: J8.37 ; also sheet 6
GPIO_PTT: J8.36 ; also sheet 5
MISO: J7.3 J8.21
MOSI: J7.4 J8.19
OSD_DATA: J10.1 ; also sheet 7
PI_3P3V: J8.1 TP29.TP
PI_3P3V_2: J8.17 TP23.TP
PI_GPCLK0: J8.7 TP25.TP
PI_GPIO5: J8.29 TP21.TP
PI_GPIO22: J8.15 TP24.TP
PI_GPIO23: J8.16 TP12.TP
PI_GPIO24: J8.18 TP13.TP
PI_GPIO25: J8.22 TP14.TP
PI_MISO1: J8.35 TP19.TP
PI_MOSI1: J8.38 TP17.TP
PI_PWM0: J8.12 TP11.TP
PI_PWM0_2: J8.32 TP16.TP
PI_PWM1: J8.33 TP20.TP
PI_SCL1: J8.5 TP28.TP
PI_SCLK1: J8.40 TP18.TP
PI_SDA1: J8.3 TP27.TP
PI_SS1: J8.26 TP15.TP
PI_UART_RXD: J8.10 TP10.TP
POT_A: J9.1 ; also sheet 6
POT_B: J9.2 ; also sheet 6
POT_W: J9.3 ; also sheet 6
SCL: J6.2 J8.28 ; also sheet 4,6
SCLK: J7.2 J8.23
SDA: J6.1 J8.27 ; also sheet 4,6
SS: J7.1 J8.24
UART_TXD: J8.8 ; also sheet 7
VID_IN0: J11.1 ; also sheet 7
VID_IN1: J12.1 ; also sheet 7
VID_IN2: J13.1 ; also sheet 7
VID_IN3: J14.1 ; also sheet 7
VID_OUT: J15.1 ; also sheet 7
WDT_BITE_N: J21.4 ; also sheet 1
WDT_PET: J8.31 ; also sheet 1
Unconnected: J21.1 J21.3

### Notes on the sheet
- COMMS Connectors
- APRS I2C Connector
- Pi Zero Run Pin Connector
- DAQCS SPI Connector
- OSD Power Connector
- ATV POT Connector
- OSD Data Connector | OSD Video Connector
- Analog Video Camera Connector #1
- Analog Video Camera Connector #2 | Analog Video Camera Connector #3
- Analog Video Camera Connector #4
- Pi Zero Connector
- 11.1V Battery | ATV Transmitter Power
- Antenna Ground Connector
- 7.4V Battery | 2m Transceiver Power

## Library data of the parts
C1 C10 C16 C25 C30-C35 = comms:CAP: Chip Capacitor; MANUFACTURER: AVX Corporation; MANUFACTURER_PN: 08053C104KAT2A; TEMP_COEFF: X7R; TOLERANCE: 10%; VENDOR: Digi-Key; VENDOR_PN: 478-3755-1-ND; VOLTAGE: 25V
C2 C4 = comms:CAP: Chip Capacitor; MANUFACTURER: Murata Electronics North America; MANUFACTURER_PN: GRM21BR61C106KE15L; TEMP_COEFF: X5R; TOLERANCE: 10%; VENDOR: Digi-Key; VENDOR_PN: 490-3886-1-ND; VOLTAGE: 16V
C3 C12 C24 C28 = comms:CAP: Chip Capacitor; MANUFACTURER: Murata Electronics North America; MANUFACTURER_PN: GRM31CR61A226ME19L; TEMP_COEFF: X5R; TOLERANCE: 20%; VENDOR: Digi-Key; VENDOR_PN: 490-4738-1-ND; VOLTAGE: 10V
C5 C8 C9 = comms:CAP: Chip Capacitor; MANUFACTURER: Murata; MANUFACTURER_PN: GRM188R61C105KA93D; TEMP_COEFF: X5R; TOLERANCE: 10%; VENDOR: Digi-Key; VENDOR_PN: 490-1536-1-ND; VOLTAGE: 16V
C6 C22 = comms:CAP: Chip Capacitor; MANUFACTURER: Kemet; MANUFACTURER_PN: C0805C103K5RACTU; TEMP_COEFF: X7R; TOLERANCE: 10%; VENDOR: Digi-Key; VENDOR_PN: 399-1158-1-ND; VOLTAGE: 50V
C7 = comms:CAP: Chip Capacitor; MANUFACTURER: Murata; MANUFACTURER_PN: GRM188R60J475KE19D; TEMP_COEFF: X5R; TOLERANCE: 10%; VENDOR: Digi-Key; VENDOR_PN: 490-3297-1-ND; VOLTAGE: 6.3V
C11 = comms:CAP: Chip Capacitor; MANUFACTURER: Murata; MANUFACTURER_PN: GRM32ER61E226KE15L; TEMP_COEFF: X5R; TOLERANCE: 10%; VENDOR: Digi-key; VENDOR_PN: 490-3889-1-ND; VOLTAGE: 25V
C13 C20 = comms:CAP: Chip Capacitor; MANUFACTURER: Murata; MANUFACTURER_PN: GRM21BR61E475MA12L; TEMP_COEFF: X5R; TOLERANCE: 20%; VENDOR: Digi-Key; VENDOR_PN: 490-5422-1-ND; VOLTAGE: 25V
C14 = comms:CAP: Chip Capacitor; MANUFACTURER: Murata; MANUFACTURER_PN: GRM31CR60J107ME39L; TEMP_COEFF: X5R; TOLERANCE: 20%; VENDOR: Digi-Key; VENDOR_PN: 490-4539-1-ND; VOLTAGE: 6.3V
C15 = comms:CAP: Chip Capacitor; MANUFACTURER: AVX Corporation; MANUFACTURER_PN: TPSB475K020R1000; TOLERANCE: 10%; VENDOR: Digi-Key; VENDOR_PN: 478-2402-1-ND; VOLTAGE: 20V
C17 = comms:CAP: Chip Capacitor; MANUFACTURER: Murata; MANUFACTURER_PN: GRM2165C2A132JA01D; TEMP_COEFF: C0G,NP0; TOLERANCE: 5%; VENDOR: Digi-Key; VENDOR_PN: 490-8290-1-ND; VOLTAGE: 100V
C18 = comms:CAP: Chip Capacitor; MANUFACTURER: Murata; MANUFACTURER_PN: GRM188R71H563KA93D; TEMP_COEFF: X7R; TOLERANCE: 10%; VENDOR: Digi-key; VENDOR_PN: 490-7770-1-ND; VOLTAGE: 50V
C19 = comms:CAP: Chip Capacitor; MANUFACTURER: Samsung Electro-Mechanics America, Inc.; MANUFACTURER_PN: CL21C621JBCNNNC; TEMP_COEFF: C0G, NP0; TOLERANCE: 5%; VENDOR: Digi-Key; VENDOR_PN: 1276-2677-1-ND; VOLTAGE: 50V
C21 = comms:CAP: Chip Capacitor; MANUFACTURER: Murata; MANUFACTURER_PN: GRM32ER61C476ME15L; TEMP_COEFF: X5R; TOLERANCE: 20%; VENDOR: Digi-Key; VENDOR_PN: 490-3888-1-ND; VOLTAGE: 16V
C23 C26 C27 C29 C36 = comms:CAP: Chip Capacitor; MANUFACTURER: Murata; MANUFACTURER_PN: GRM188R71C104KA01D; TEMP_COEFF: X7R; TOLERANCE: 10%; VENDOR: Digi-key; VENDOR_PN: 490-1532-1-ND; VOLTAGE: 16V
D1 = comms:DIODE-SCHOTTKY: Schottky diodes in SFE's production catalog BAT20J 1A 23V 0.62Vf RB751 120mA 40V 0.37Vf PMEG4005EJ 0.5A 40V 0.42Vf MBRA140 1A 40V 0.5Vf B340A 3A 40V SMA; CAP_REV_V: 200pF @4V, 1MHz; CURRENT_AVG_RECT: 3A; CURRENT_REV_LEAK: 500uA @40V; MANUFACTURER: Comchip; MANUFACTURER_PN: CDBA340-HF; VENDOR: Digi-key; VENDOR_PN: 641-1748-1-ND; VOLTAGE_DC_REV: 40V; VOLTAGE_FWD: 500mV @3A
H1-H4 = comms:MOUNT-HOLE: MOUNTING HOLE with drill center marker
J1 = comms:SMA_EDGE: SMA Antenna Connector End launch SMA connector. The paste layer has been removed so that the connector can be hand soldered onto the board after reflow.; MANUFACTURER: Sparkfun; MANUFACTURER_PN: WRL-00593; VENDOR: Sparkfun; VENDOR_PN: WRL-00593
J2-J5 = comms:PRT-12639: Audio jack - 3.5mm TRRS; MANUFACTUER_PN: PRT-12639; MANUFACTURER: Sparkfun; VENDOR: SPARKFUN; VENDOR_PN: PRT-12639
J6 J9 J11-J14 = comms:MOLSL_3PIN: Molex SL Series 3-Position Connector Wire to board 2.54 mm (.1 inch) pitch header (right-angle or vertical) Housing: Vendor=Molex, Vendor_PN=0050579403 22-24 AWG Crimp: Vendor=Molex, Vendor_PN=0016020087 Wires: AWG,Amps (Max) 22, 3.0 24, 3.0 26, 1.8 28, 1.2; FINISH: GOLD; LOCKING: YES; MANUFACTURER: Molex; MANUFACTURER_PN: 0705530002; MAX_CURRENT: 3.0A; MOUNT_ANGLE: RIGHT; MOUNT_TYPE: TH; POSITIONS: 3; VENDOR: Digi-key; VENDOR_PN: WM4901-ND
J7 = comms:MOLSL_5PIN: Molex SL Series 5-Position Connector Wire to board 2.54 mm (.1 inch) pitch header (right-angle or vertical) Housing: Vendor=Molex, Vendor_PN=0050579405 22-24 AWG Crimp: Vendor=Molex, Vendor_PN=0016020087 Wires: AWG,Amps (Max) 22, 3.0 24, 3.0 26, 1.8 28, 1.2; FINISH: GOLD; LOCKING: YES; MANUFACTURER: Molex; MANUFACTURER_PN: 0705530004; MAX_CURRENT: 3.0A; MOUNT_ANGLE: RIGHT; MOUNT_TYPE: TH; POSITIONS: 5; VENDOR: Digi-key; VENDOR_PN: WM4903-ND
J8 = comms:RECEPTACLE-2X20-254MM: .100” [2.54 mm] Contact Centers, 2x20 Female Header, Vertical/SMT; FINISH: Gold; MANUFACTURER: Sullins Connector Solutions; MANUFACTURER_PN: SFH11-PBPC-D20-ST-BK; MAX_CURRENT: 3A; MOUNT_ANGLE: Vertical; MOUNT_TYPE: TH; PITCH: 2.54mm; POSITIONS: 40; ROWS: 2; VENDOR: Digi-Key; VENDOR_PN: S9200-ND
J10 J15 J20 J22 = comms:MOLSL_2PIN: Molex SL Series 2-Position Connector Wire to board 2.54 mm (.1 inch) pitch header (right-angle or vertical) Housing: Vendor=Molex, Vendor_PN=0050579402 22-24 AWG Crimp: Vendor=Molex, Vendor_PN=0016020087 Wires: AWG,Amps (Max) 22, 3.0 24, 3.0 26, 1.8 28, 1.2; FINISH: GOLD; LOCKING: YES; MANUFACTURER: Molex; MANUFACTURER_PN: 0705530001; MAX_CURRENT: 3.0A; MOUNT_ANGLE: RIGHT; MOUNT_TYPE: TH; POSITIONS: 2; VENDOR: Digi-key; VENDOR_PN: WM4900-ND
J16-J19 = comms:39-30-?02?: Mini-fit JR 2pin connector; FINISH: GOLD; LOCKING: YES; MANUFACTURER: Molex; MANUFACTURER_PN: 0039301021; MAX_CURRENT: 13.0A; MOUNT_ANGLE: RIGHT; MOUNT_TYPE: TH; POSITIONS: 2; VENDOR: Digi-Key; VENDOR_PN: WM1363-ND
J21 = comms:RECEPTACLE-2X2-254MM: .100" [2.54mm] Contact CEnters, 2x2 Female Header, Vertical; FINISH: Gold; MANUFACTURER: Sullins Connector Solutions; MANUFACTURER_PN: PPPC022LFBN-RC; MAX_CURRENT: 3A; MOUNT_ANGLE: Vertical; MOUNT_TYPE: TH; PITCH: 2.54mm; POSITIONS: 4; ROWS: 2; VENDOR: Digi-Key; VENDOR_PN: S7105-ND
L1 L2 = comms:L: Surface Mount Inductor; CURRENT_DC: 3A; CURRENT_SAT: 4A; DCR_MAX: 37.6mOHM; MANUFACTURER: Bourns Inc.; MANUFACTURER_PN: SRN6045-4R7Y; SHIELDED: Yes; TOLERANCE: 30%; TYPE: Wirewound; VENDOR: Digi-Key; VENDOR_PN: SRN6045-4R7YCT-ND
L3 = comms:L: Surface Mount Inductor; CURRENT_DC: 2.15A; CURRENT_SAT: 3.8A; DCR_MAX: 90 mOHM; MANUFACTURER: Bourns Inc; MANUFACTURER_PN: SDR1006-180ML; SHIELDED: No; TOLERANCE: 20%; TYPE: Wirewound; VENDOR: Digi-Key; VENDOR_PN: SDR1006-180MLCT-ND
L4 = comms:L: Surface Mount Inductor; CURRENT_DC: 2.1A; CURRENT_SAT: 3.8A; DCR_MAX: 130 mOHM; MANUFACTURER: Bourns Inc; MANUFACTURER_PN: SDR1806-680ML; SHIELDED: No; TOLERANCE: 20%; TYPE: Wirewound; VENDOR: Digi-Key; VENDOR_PN: SDR1806-680MLCT-ND
L5 = comms:L: Surface Mount Inductor; CURRENT_DC: 300mA; CURRENT_SAT: -; DCR_MAX: 0.550; MANUFACTURER: Murata; MANUFACTURER_PN: LQG18HN27NJ00D; SHIELDED: Unshielded; TOLERANCE: 5%; TYPE: CHIP; VENDOR: Digikey; VENDOR_PN: 490-6579-1-ND
L6 = comms:L: Surface Mount Inductor; CURRENT_DC: 3.2A; CURRENT_SAT: 5A; DCR_MAX: 30.2mOHM; MANUFACTURER: Bourns Inc.; MANUFACTURER_PN: SRN6045-3R3Y; SHIELDED: Yes; TOLERANCE: 30%; TYPE: Wirewound; VENDOR: Digi-Key; VENDOR_PN: SRN6045-3R3YCT-ND
LED1 = comms:LED: LED OSRAM: - CHIPLED LG R971, LG N971, LY N971, LG Q971, LY Q971, LO R971, LY R971 LH N974, LH R974 LS Q976, LO Q976, LY Q976 LO Q996 - Hyper CHIPLED LW Q18S LB Q993, LB Q99A, LB R99A - SideLED LS A670, LO A670, LY A670, LG A670, LP A670 LB A673, LV A673, LT A673, LW A673 LH A674 LY A675 LS A676, LA A676, LO A676, LY A676, LW A676 LS A679, LY A679, LG A679 - Hyper Micro SIDELED® LS Y876, LA Y876, LO Y876, LY Y876 LT Y87S - SmartLED LW L88C, LW L88S LB L89C, LB L89S, LG L890 LS L89K, LO L89K, LY L89K LS L896, LA L896, LO L896, LY L896 - TOPLED LS T670, LO T670, LY T670, LG T670, LP T670 LSG T670, LSP T670, LSY T670, LOP T670, LYG T670 LG T671, LOG T671, LSG T671 LB T673, LV T673, LT T673, LW T673 LH T674 LS T676, LA T676, LO T676, LY T676, LB T676, LH T676, LSB T676, LW T676 LB T67C, LV T67C, LT T67C, LS T67K, LO T67K, LY T67K, LW E67C LS E67B, LA E67B, LO E67B, LY E67B, LB E67C, LV E67C, LT E67C LW T67C LS T679, LY T679, LG T679 LS T770, LO T770, LY T770, LG T770, LP T770 LB T773, LV T773, LT T773, LW T773 LH T774 LS E675, LA E675, LY E675, LS T675 LS T776, LA T776, LO T776, LY T776, LB T776 LHGB T686 LT T68C, LB T68C - Hyper Mini TOPLED® LB M676 - Mini TOPLED Santana® LG M470 LS M47K, LO M47K, LY M47K Source: http://www.osram.convergy.de/; FORWARD_CURRENT: 10mA; FORWARD_VOLTAGE: 1.8; MANUFACTURER: Lite-On; MANUFACTURER_PN: LTST-C170CKT; VENDOR: Digi-Key; VENDOR_PN: 160-1176-1-ND
NC1 NC2 = comms:NO_CONNECT: No Connect
Q1 = comms:CSD17579Q3A: MOSFET N-CH 30V 35A 8VSON; MANUFACTURER: Texas Instruments; MANUFACTURER_PN: CSD17579Q3A; VENDOR: Digi-Key; VENDOR_PN: 296-39998-1-ND
R1 R3 = comms:RES: Chip Resistor; MANUFACTURER: Panasonic; MANUFACTURER_PN: ERJ-3EKF5622V; POWER: 1/10W; TOLERANCE: 1%; VENDOR: Digi-key; VENDOR_PN: P56.2KHCT-ND
R2 R4 R13 R18 R20 R41 = comms:RES: Chip Resistor; MANUFACTURER: Panasonic; MANUFACTURER_PN: ERJ-3EKF1002V; POWER: 1/10W; TOLERANCE: 1%; VENDOR: Digi-key; VENDOR_PN: P10.0KHCT-ND
R5 = comms:RES: Chip Resistor; MANUFACTURER: Panasonic; MANUFACTURER_PN: ERJ-3EKF1743V; POWER: 1/10W; TOLERANCE: 1%; VENDOR: Digi-key; VENDOR_PN: P174KHCT-ND
R6 = comms:RES: Chip Resistor; MANUFACTURER: Panasonic; MANUFACTURER_PN: ERJ-3EKF2552V; POWER: 1/10W; TOLERANCE: 1%; VENDOR: Digi-key; VENDOR_PN: P25.5KHCT-ND
R7 = comms:RES: Chip Resistor; MANUFACTURER: Panasonic; MANUFACTURER_PN: ERJ-3EKF5362V; POWER: 1/10W; TOLERANCE: 1%; VENDOR: Digi-key; VENDOR_PN: P53.6KHCT-ND
R8 = comms:RES: Chip Resistor; MANUFACTURER: Panasonic; MANUFACTURER_PN: ERJ-6ENF1821V; POWER: 1/8W; TOLERANCE: 1%; VENDOR: Digi-Key; VENDOR_PN: P1.82KCCT-ND
R9 = comms:RES: Chip Resistor; MANUFACTURER: Panasonic; MANUFACTURER_PN: ERJ-3EKF3012V; POWER: 1/10W; TOLERANCE: 1%; VENDOR: Digi-Key; VENDOR_PN: P30.1KHCT-ND
R10 = comms:RES: Chip Resistor; MANUFACTURER: Panasonic; MANUFACTURER_PN: ERJ-6BWFR030V; POWER: 1/2W; TOLERANCE: 1%; VENDOR: Digi-Key; VENDOR_PN: P.03AQCT-ND
R11 = comms:RES: Chip Resistor; MANUFACTURER: Panasonic; MANUFACTURER_PN: ERJ-3EKF1000V; POWER: 1/10W; TOLERANCE: 1%; VENDOR: Digi-Key; VENDOR_PN: P100HCT-ND
R12 = comms:RES: Chip Resistor; MANUFACTURER: Panasonic; MANUFACTURER_PN: ERJ-3EKF8452V; POWER: 1/10W; TOLERANCE: 1%; VENDOR: Digi-Key; VENDOR_PN: P84.5KHCT-ND
R14 R15 R19 R46 R47 R52 R53 = comms:RES: Chip Resistor; MANUFACTURER: Panasonic; MANUFACTURER_PN: ERJ-3GEY0R00V; POWER: 1/10W; TOLERANCE: JUMPER; VENDOR: Digi-key; VENDOR_PN: P0.0GCT-ND
R16 = comms:RES: Chip Resistor; MANUFACTURER: Panasonic; MANUFACTURER_PN: ERJ-3EKF10R0V; POWER: 1/10W; TOLERANCE: 1%; VENDOR: Digi-key; VENDOR_PN: P10.0HCT-ND
R17 = comms:RES: Chip Resistor; MANUFACTURER: Panasonic; MANUFACTURER_PN: ERJ-6ENF1500V; POWER: 1/8W; TOLERANCE: 1%; VENDOR: Digi-Key; VENDOR_PN: P150CCT-ND
R21-R24 R27-R30 R34 R36 R48-R51 R55 R56 = comms:RES: Chip Resistor; MANUFACTURER: Panasonic; MANUFACTURER_PN: ERJ-6GEY0R00V; POWER: 1/8W; TOLERANCE: JUMPER; VENDOR: Digi-Key; VENDOR_PN: P0.0ACT-ND
R25 R26 = comms:RES: Chip Resistor; MANUFACTURER: Panasonic; MANUFACTURER_PN: ERJ-3EKF4701V; POWER: 1/10W; TOLERANCE: 1%; VENDOR: Digi-Key; VENDOR_PN: P4.70KHCT-ND
R37 = comms:RES: Chip Resistor; MANUFACTURER: Panasonic; MANUFACTURER_PN: ERJ-3EKF1001V; POWER: 1/10W; TOLERANCE: 1%; VENDOR: Digi-key; VENDOR_PN: P1.00KHCT-ND
R40 = comms:RES: Chip Resistor; MANUFACTURER: Panasonic; MANUFACTURER_PN: ERJ-3EKF3322V; POWER: 1/10W; TOLERANCE: 1%; VENDOR: Digi-Key; VENDOR_PN: P33.2KHCT-ND
R42-R45 R54 = comms:RES: Chip Resistor; MANUFACTURER: Panasonic; MANUFACTURER_PN: ERJ-3EKF75R0V; POWER: 1/10W; TOLERANCE: 1%; VENDOR: Digi-key; VENDOR_PN: P75.0HCT-ND
TP1-TP38 = comms:TP: Test pad
U1 U4 U11 = comms:TPS562209: Buck Switching Regulator IC Positive Adjustable 0.765V 1 Output 2A SOT-23-6 Thin, TSOT-23-6; MANUFACTURER: Texas Instruments; MANUFACTURER_PN: TPS562209DDCT; VENDOR: Digi-Key; VENDOR_PN: 296-37302-1-ND
U2 = comms:LP2985-33: Linear Voltage Regulator IC Positive Fixed 1 Output 3.3V 150mA SOT-23-5; MANUFACTURER: Texas Instruments; MANUFACTURER_PN: LP2985-33DBVR; VENDOR: Digi-Key; VENDOR_PN: 296-18476-1-ND
U3 = comms:LP5900: Linear Voltage Regulator IC Positive Fixed 1 Output 3.3V 150mA 4-DSBGA; MANUFACTURER: Texas Instruments; MANUFACTURER_PN: LP5900TLX-3.3/NOPB; VENDOR: Digi-Key; VENDOR_PN: LP5900TLX-3.3/NOPBCT-ND
U5 = comms:LMZ34002: Non-Isolated PoL Module DC DC Converter 1 Output -3 ~ -17 V 2A 4.5V - 40V Input; MANUFACTURER: Texas Instruments; MANUFACTURER_PN: LMZ34002RKGR; VENDOR: Digi-Key; VENDOR_PN: 296-44356-1-ND
U6 = comms:LM3488: Boost, Flyback, SEPIC Regulator Positive Output Step-Up, Step-Up/Step-Down DC-DC Controller IC 8-VSSOP; MANUFACTURER: Texas Instruments; MANUFACTURER_PN: LM3488MMX/NOPB; VENDOR: Digi-Key; VENDOR_PN: 296-35417-1-ND
U7 = comms:PCT2075: I2C-bus Fm+, 1 degree C accuracy, digital temperature sensor and thermal watchdog; INTERFACE: I2C; MANUFACTURER: NXP; MANUFACTURER_PN: PCT2075D,118; RESOLUTION: 10b; VENDOR: Digi-key; VENDOR_PN: 568-10219-1-ND
U8 = comms:MS5607: Barometric Pressure Sensor, with stainless steel cap Specs High resolution module, 20cm Fast conversion down to 1 ms Low power, 1 μA (standby < 0.15 μA) QFN package 5.0 x 3.0 x 1.0 mm3 Supply voltage 1.8 to 3.6 V Integrated digital pressure sensor (24 bit ΔΣ ADC) Operating range: 10 to 1200 mbar, -40 to +85 °C I2C and SPI interface up to 20 MHz No external components (Internal oscillator) Excellent long term stability; INTERFACE: I2C,SPI; MANUFACTURER: TE Connectivity; MANUFACTURER_PN: MS560702BA03-50; OUTPUT_BITS: 24b; PRESSURE_TYPE: Absolute; VENDOR: Digi-key; VENDOR_PN: 223-1198-1-ND
U9 = comms:UBLOX_MAX: UBLOX MAX; MANUFACTURER: u-blox; MANUFACTURER_PN: MAX-M8Q; VENDOR: Digi-Key; VENDOR_PN: 672-1003-1-ND
U10 = comms:MCP4541-103E/MS: Digital POT; MANUFACTUER_PN: MCP4541-103E/MS; MANUFACTURER: Microchip; MPN: MCP4541-103E/MS; OC_FARNELL: 1698945; OC_NEWARK: 77M2864; PACKAGE: SOP-8; VENDOR: Digi-Key; VENDOR_PN: MCP4541T-103E/MFCT-ND
U12 = comms:MMBT3904-7-F: NPN SMALL SIGNAL SURFACE MOUNT TRANSISTOR; MANUFACTURER: Diodes, Inc; MANUFACTURER_PN: MMBT3904-7-F; VENDOR: Digikey; VENDOR_PN: MMBT3904-FDICT-ND
U13 = comms:MAX232: RS232 Transceiver Very common IC. This is generically called 'MAX232', but works with the 3V equivalent MAX3232 generic ICs. Field tested and mother approved. Spark Fun Electronics SKU : COM-00316 (DIP) and COM-00589 (SMD); MANUFACTURER: Maxim; MANUFACTURER_PN: MAX3232CSE+; VENDOR: Digikey; VENDOR_PN: MAX3232CSE+-ND
U14 = comms:MAX4311: Video Multiplexer-Amplifier High-Speed, Low-Power, Single-Supply, Multichannel; MANUFACTURER: Maxim; MANUFACTURER_PN: MAX4311EEE+; VENDOR: Digikey; VENDOR_PN: MAX4311EEE+-ND
U15 = daqcs:MAX63XX: Pin-Selectable Watchdog Timer; MANUFACTURER: Maxim; MANUFACTURER_PN: MAX6371KA+T; OUTPUT_ACTIVE: Low; OUTPUT_ACTIVE_TIME: 120us (min); OUTPUT_TYPE: Open Drain; STARTUP_DELAY: 60s; TIMEOUT: Adjustable (up to 60s); VENDOR: Digikey; VENDOR_PN: MAX6371KA+TCT-ND